# EAGLE board piezo-driver_v0.95-R001 (EAGLE 6.5.0), part 1 of 2
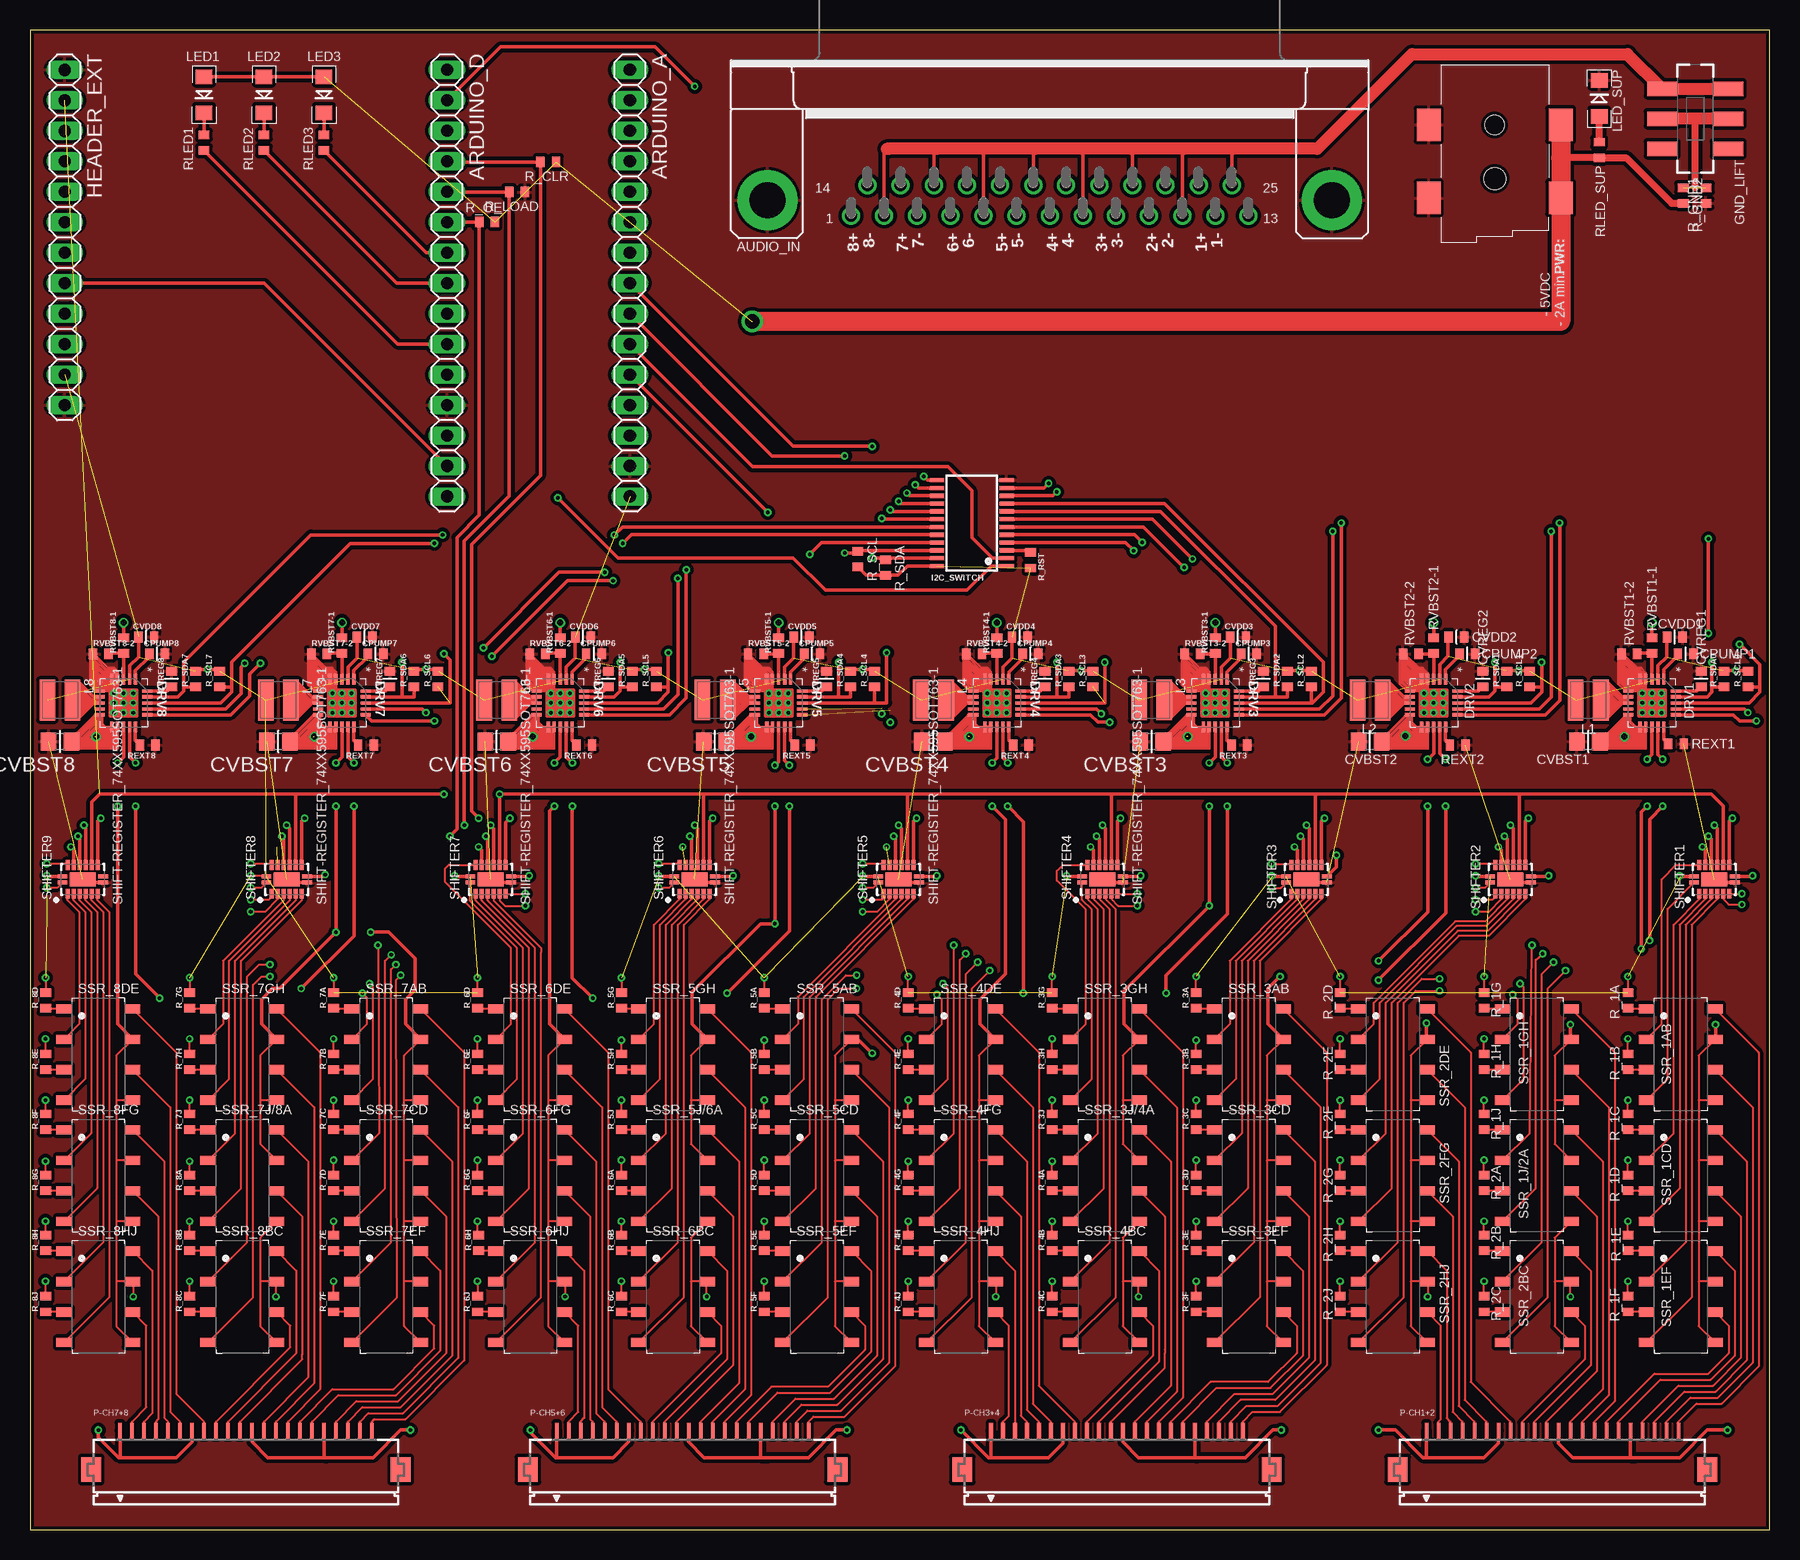
[diagram p5: board, top side]
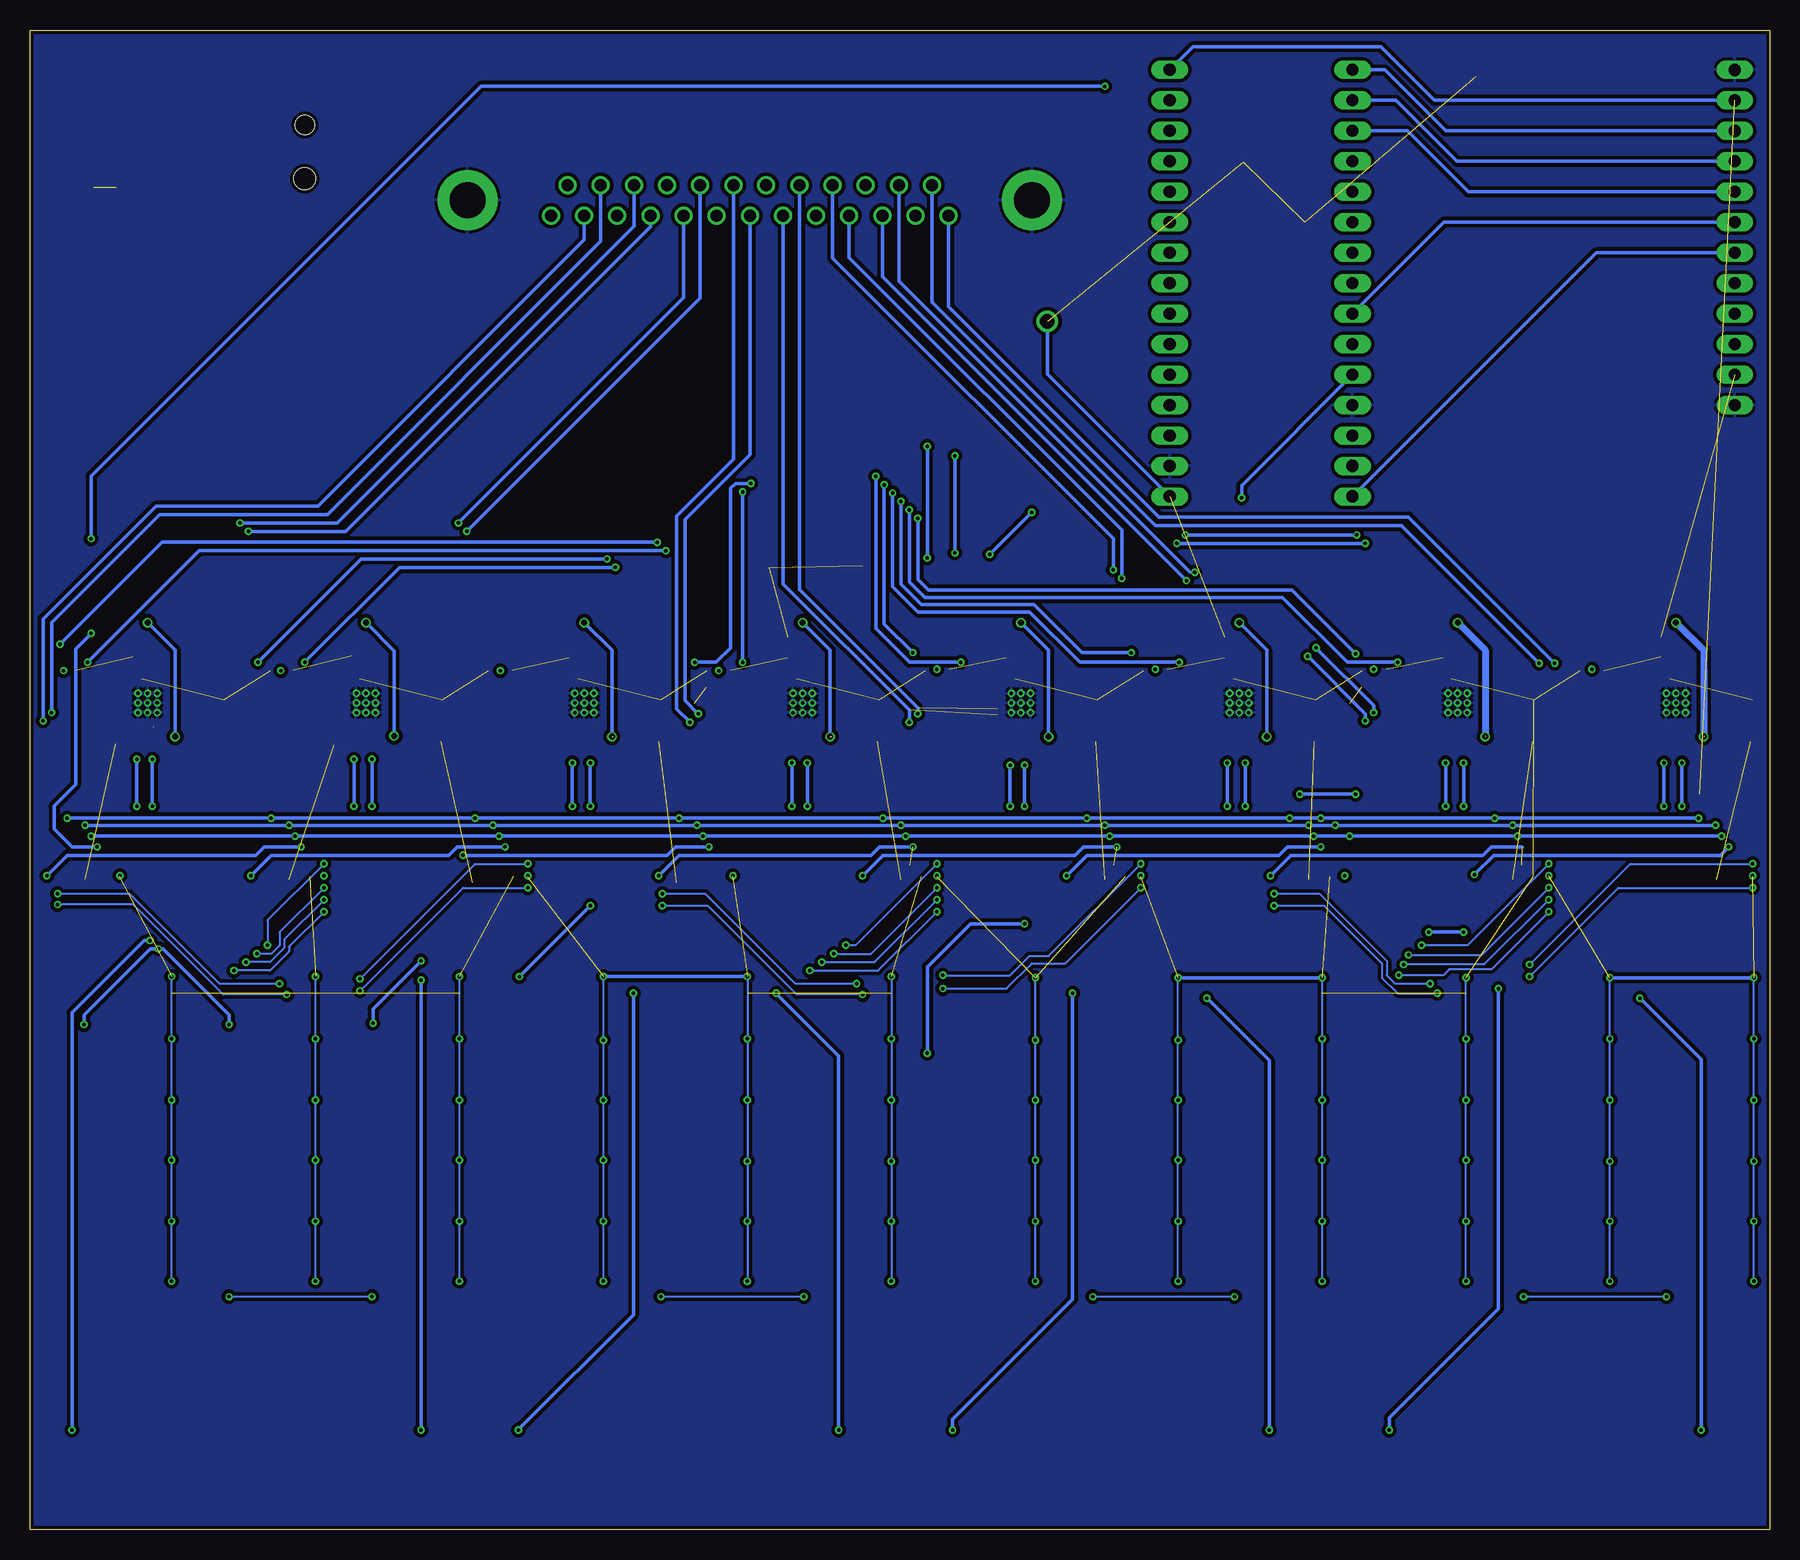
[diagram p6: board, bottom side, seen from below]

Size 145 x 125 mm. Coordinates in mm from the lower left corner, seen from the top.
Outline: 0,0 145,0 145,125 0,125 0,0
Copper layers (1*16): Top 0.035mm / dielectric 1.5mm / Bottom 0.035mm
Design rules "2L-1.6mm-0.15_0.3mm *": minimum track width 0.15mm, minimum drill 0.3mm, track to track 0.15mm, track to pad 0.15mm, pad to pad 0.15mm, via to via 0.15mm, smd to smd 0.15mm, copper to edge 0.3mm, drill to drill 0.5mm, minimum pad ring 0.15mm, minimum via ring 0.15mm, stop-mask expansion 0.1mm, vias tented up to drill 0.8mm, thermal gap 0.25mm

## Footprints (pad centres in the part's own frame; a part is rotated, then mirrored left to right if it is on the bottom)
1X15 = drill 1.016 long: 1 -17.78,0; 2 -15.24,0; 3 -12.7,0; 4 -10.16,0; 5 -7.62,0; 6 -5.08,0; 7 -2.54,0; 8 0,0; 9 2.54,0; 10 5.08,0; 11 7.62,0; 12 10.16,0; 13 12.7,0; 14 15.24,0; 15 17.78,0
F25HP = drill 1: 1 -16.561,-1.27; 2 -13.792,-1.27; 3 -11.049,-1.27; 4 -8.28,-1.27; 5 -5.512,-1.27; 6 -2.769,-1.27; 7 0,-1.27; 8 2.769,-1.27; 9 5.512,-1.27; 10 8.28,-1.27; 11 11.049,-1.27; 12 13.792,-1.27; 13 16.561,-1.27; 14 -15.189,1.27; 15 -12.421,1.27; 16 -9.652,1.27; 17 -6.909,1.27; 18 -4.14,1.27; 19 -1.372,1.27; 20 1.372,1.27; 21 4.14,1.27; 22 6.909,1.27; 23 9.652,1.27; 24 12.421,1.27; 25 15.189,1.27 | drill 3 pad 5: G1 -23.52,0; G2 23.52,0
C0402 = smd 0.7 x 0.9: 1 -0.65,0; 2 0.65,0
C0805 = smd 1.3 x 1.5: 1 -0.95,0; 2 0.95,0
QFN-20_9TH = smd 0.85 x 0.28: 1 -1.981,0.991; 2 -1.981,0.508; 3 -1.981,0; 4 -1.981,-0.508; 5 -1.981,-0.991; 11 1.981,-0.991; 12 1.981,-0.508; 13 1.981,0; 14 1.981,0.508; 15 1.981,0.991 | smd 0.28 x 0.85: 6 -0.991,-1.981; 7 -0.508,-1.981; 8 0,-1.981; 9 0.508,-1.981; 10 0.991,-1.981; 16 0.991,1.981; 17 0.508,1.981; 18 0,1.981; 19 -0.508,1.981; 20 -0.991,1.981 | drill 0.3 pad 0.5: PAD1 -0.8,0.8; PAD2 0,0.8; PAD3 0.8,0.8; PAD4 -0.8,0; PAD5 0,0; PAD6 0.8,0; PAD7 -0.8,-0.8; PAD8 0,-0.8; PAD9 0.8,-0.8
SWITCH_JS202011 = smd 1.2 x 2.5: 1 -2.5,-2.75; 2 0,-2.75; 3 2.5,-2.75; 4 2.5,2.75; 5 0,2.75; 6 -2.5,2.75
1X12 = drill 1.016 long: 1 -13.97,0; 2 -11.43,0; 3 -8.89,0; 4 -6.35,0; 5 -3.81,0; 6 -1.27,0; 7 1.27,0; 8 3.81,0; 9 6.35,0; 10 8.89,0; 11 11.43,0; 12 13.97,0
TSSOP24 = smd 0.35 x 1.2: 1 -3.575,-2.9; 2 -2.925,-2.9; 3 -2.275,-2.9; 4 -1.625,-2.9; 5 -0.975,-2.9; 6 -0.325,-2.9; 7 0.325,-2.9; 8 0.975,-2.9; 9 1.625,-2.9; 10 2.275,-2.9; 11 2.925,-2.9; 12 3.575,-2.9; 13 3.575,2.9; 14 2.925,2.9; 15 2.275,2.9; 16 1.625,2.9; 17 0.975,2.9; 18 0.325,2.9; 19 -0.325,2.9; 20 -0.975,2.9; 21 -1.625,2.9; 22 -2.275,2.9; 23 -2.925,2.9; 24 -3.575,2.9
L3030 = smd 1.3 x 3.4: 1 -1.05,0; 2 1.05,0
LED-1206 = smd 1.2 x 1.4: A -1.5,0; C 1.5,0
FH12-22S-1SH = smd 0.3 x 1.3: 1 -10.5,3.25; 2 -9.5,3.25; 3 -8.5,3.25; 4 -7.5,3.25; 5 -6.5,3.25; 6 -5.5,3.25; 7 -4.5,3.25; 8 -3.5,3.25; 9 -2.5,3.25; 10 -1.5,3.25; 11 -0.5,3.25; 12 0.5,3.25; 13 1.5,3.25; 14 2.5,3.25; 15 3.5,3.25; 16 4.5,3.25; 17 5.5,3.25; 18 6.5,3.25; 19 7.5,3.25; 20 8.5,3.25; 21 9.5,3.25; 22 10.5,3.25 | smd 1.65 x 2.05: PAD1 -12.9,0; PAD2 12.9,0
LUMBERG-1613_14 = smd 2 x 2.7: 1 5.5,5; 2 5.5,11.1; 3 -5.5,11.1; 4 -5.5,5 | hole 1.6: 0,5 | hole 1.8: 0,9.5
R0402 = smd 0.7 x 0.9: 1 -0.65,0; 2 0.65,0
SOT763-1 = smd 0.8 x 0.35: 1 -1.7,-0.25; 8 1.7,-0.25; 9 1.7,0.25; 16 -1.7,0.25 | smd 0.35 x 0.8: 2 -1.25,-1.2; 3 -0.75,-1.2; 4 -0.25,-1.2; 5 0.25,-1.2; 6 0.75,-1.2; 7 1.25,-1.2; 10 1.25,1.2; 11 0.75,1.2; 12 0.25,1.2; 13 -0.25,1.2; 14 -0.75,1.2; 15 -1.25,1.2 | smd 2.15 x 1.15: PAD 0,0
SOP8 = smd 0.76 x 1.27: 1 -3.81,-2.86; 2 -1.27,-2.86; 3 1.27,-2.86; 4 3.81,-2.86; 5 3.81,2.86; 6 1.27,2.86; 7 -1.27,2.86; 8 -3.81,2.86

## Placement (x,y rotation side)
ARDUINO_A  [1X15]  50,103.9 270 top
ARDUINO_D  [1X15]  34.76,103.9 270 top
AUDIO_IN  [F25HP]  85,110.8 0 top
CPUMP1  0.1u  [C0402]  138,73 0 top
CPUMP2  0.1u  [C0402]  119.8,73 0 top
CPUMP3  0.1u  [C0402]  101.6,73 0 top
CPUMP4  0.1u  [C0402]  83.4,73 0 top
CPUMP5  0.1u  [C0402]  65.2,73 0 top
CPUMP6  0.1u  [C0402]  47,73 0 top
CPUMP7  0.1u  [C0402]  28.8,73 0 top
CPUMP8  0.1u  [C0402]  10.6,73 0 top
CVBST1  100n, 250V  [C0805]  129.9,65.7 180 top
CVBST2  100n, 250V  [C0805]  111.7,65.7 180 top
CVBST3  100n, 250V  [C0805]  93.5,65.7 180 top
CVBST4  100n, 250V  [C0805]  75.3,65.7 180 top
CVBST5  100n, 250V  [C0805]  57.1,65.7 180 top
CVBST6  100n, 250V  [C0805]  38.9,65.7 180 top
CVBST7  100n, 250V  [C0805]  20.7,65.7 180 top
CVBST8  100n, 250V  [C0805]  2.5,65.7 180 top
CVDD1  47u  [C0402]  137.1,74.4 0 top
CVDD2  47u  [C0402]  118.9,74.4 0 top
CVDD3  47u  [C0402]  100.7,74.4 0 top
CVDD4  47u  [C0402]  82.5,74.4 0 top
CVDD5  47u  [C0402]  64.3,74.4 0 top
CVDD6  47u  [C0402]  46.1,74.4 0 top
CVDD7  47u  [C0402]  27.9,74.4 0 top
CVDD8  47u  [C0402]  9.7,74.4 0 top
CVREG1  0.1u  [C0402]  139.3,70.9 90 top
CVREG2  0.1u  [C0402]  121.1,70.9 90 top
CVREG3  0.1u  [C0402]  102.8,70.9 90 top
CVREG4  0.1u  [C0402]  84.6,70.9 90 top
CVREG5  0.1u  [C0402]  66.4,70.9 90 top
CVREG6  0.1u  [C0402]  48.2,70.9 90 top
CVREG7  0.1u  [C0402]  30,70.9 90 top
CVREG8  0.1u  [C0402]  11.8,70.9 90 top
DRV1  DRV2667  [QFN-20_9TH]  135.2,68.9 270 top
DRV2  DRV2667  [QFN-20_9TH]  117,68.9 270 top
DRV3  DRV2667  [QFN-20_9TH]  98.8,68.9 270 top
DRV4  DRV2667  [QFN-20_9TH]  80.6,68.9 270 top
DRV5  DRV2667  [QFN-20_9TH]  62.4,68.9 270 top
DRV6  DRV2667  [QFN-20_9TH]  44.2,68.9 270 top
DRV7  DRV2667  [QFN-20_9TH]  26,68.9 270 top
DRV8  DRV2667  [QFN-20_9TH]  7.8,68.9 270 top
GND_LIFT  SWITCH_DPDT  [SWITCH_JS202011]  138.8,117.6 270 top
HEADER_EXT  [1X12]  2.9,107.7 270 top
I2C_SWITCH  I2C-SWITCH_8-1TSSOP24  [TSSOP24]  78.5,83.9 90 top
L1  10u, 2.5A  [L3030]  129.89,69.14 180 top
L2  10u, 2.5A  [L3030]  111.71,69.15 180 top
L3  10u, 2.5A  [L3030]  93.5,69.16 180 top
L4  10u, 2.5A  [L3030]  75.3,69.15 180 top
L5  10u, 2.5A  [L3030]  57.1,69.16 180 top
L6  10u, 2.5A  [L3030]  38.9,69.15 180 top
L7  10u, 2.5A  [L3030]  20.7,69.15 180 top
L8  10u, 2.5A  [L3030]  2.5,69.15 180 top
LED1  red  [LED-1206]  14.5,119.6 270 top
LED2  orange  [LED-1206]  19.5,119.6 270 top
LED3  yellow  [LED-1206]  24.5,119.6 270 top
LED_SUP  green  [LED-1206]  130.8,119.3 90 top
P-CH1+2  FH12-22S-1SH-90°  [FH12-22S-1SH]  126.9,5 0 top
P-CH3+4  FH12-22S-1SH-90°  [FH12-22S-1SH]  90.6,5 0 top
P-CH5+6  FH12-22S-1SH-90°  [FH12-22S-1SH]  54.4,5 0 top
P-CH7+8  FH12-22S-1SH-90°  [FH12-22S-1SH]  18,5 0 top
PWR:  LUMBERG-1613-14"  [LUMBERG-1613_14]  122.1,122.1 180 top
R_1A  3.57k  [R0402]  133.2,44.1 90 top
R_1B  3.57k  [R0402]  133.2,39 90 top
R_1C  3.57k  [R0402]  133.2,34 90 top
R_1D  3.57k  [R0402]  133.2,28.9 90 top
R_1E  3.57k  [R0402]  133.2,23.9 90 top
R_1F  3.57k  [R0402]  133.2,18.8 90 top
R_1G  3.57k  [R0402]  121.2,44.1 90 top
R_1H  3.57k  [R0402]  121.2,39 90 top
R_1J  3.57k  [R0402]  121.2,34 90 top
R_2A  3.57k  [R0402]  121.2,28.9 90 top
R_2B  3.57k  [R0402]  121.2,23.9 90 top
R_2C  3.57k  [R0402]  121.2,18.8 90 top
R_2D  3.57k  [R0402]  109.2,44.1 90 top
R_2E  3.57k  [R0402]  109.2,39 90 top
R_2F  3.57k  [R0402]  109.2,34 90 top
R_2G  3.57k  [R0402]  109.2,28.9 90 top
R_2H  3.57k  [R0402]  109.2,23.9 90 top
R_2J  3.57k  [R0402]  109.2,18.8 90 top
R_3A  3.57k  [R0402]  97.2,44.1 90 top
R_3B  3.57k  [R0402]  97.2,39 90 top
R_3C  3.57k  [R0402]  97.2,34 90 top
R_3D  3.57k  [R0402]  97.2,28.9 90 top
R_3E  3.57k  [R0402]  97.2,23.9 90 top
R_3F  3.57k  [R0402]  97.2,18.8 90 top
R_3G  3.57k  [R0402]  85.2,44.1 90 top
R_3H  3.57k  [R0402]  85.2,39 90 top
R_3J  3.57k  [R0402]  85.2,34 90 top
R_4A  3.57k  [R0402]  85.2,28.9 90 top
R_4B  3.57k  [R0402]  85.2,23.9 90 top
R_4C  3.57k  [R0402]  85.2,18.8 90 top
R_4D  3.57k  [R0402]  73.2,44.1 90 top
R_4E  3.57k  [R0402]  73.2,39 90 top
R_4F  3.57k  [R0402]  73.2,34 90 top
R_4G  3.57k  [R0402]  73.2,28.9 90 top
R_4H  3.57k  [R0402]  73.2,23.9 90 top
R_4J  3.57k  [R0402]  73.2,18.8 90 top
R_5A  3.57k  [R0402]  61.2,44.1 90 top
R_5B  3.57k  [R0402]  61.2,39 90 top
R_5C  3.57k  [R0402]  61.2,34 90 top
R_5D  3.57k  [R0402]  61.2,28.9 90 top
R_5E  3.57k  [R0402]  61.2,23.9 90 top
R_5F  3.57k  [R0402]  61.2,18.8 90 top
R_5G  3.57k  [R0402]  49.3,44.1 90 top
R_5H  3.57k  [R0402]  49.3,39 90 top
R_5J  3.57k  [R0402]  49.3,34 90 top
R_6A  3.57k  [R0402]  49.3,28.9 90 top
R_6B  3.57k  [R0402]  49.3,23.9 90 top
R_6C  3.57k  [R0402]  49.3,18.8 90 top
R_6D  3.57k  [R0402]  37.3,44.1 90 top
R_6E  3.57k  [R0402]  37.3,39 90 top
R_6F  3.57k  [R0402]  37.3,34 90 top
R_6G  3.57k  [R0402]  37.3,28.9 90 top
R_6H  3.57k  [R0402]  37.4,23.9 90 top
R_6J  3.57k  [R0402]  37.3,18.8 90 top
R_7A  3.57k  [R0402]  25.3,44.1 90 top
R_7B  3.57k  [R0402]  25.3,39 90 top
R_7C  3.57k  [R0402]  25.3,34 90 top
R_7D  3.57k  [R0402]  25.3,28.9 90 top
R_7E  3.57k  [R0402]  25.3,23.9 90 top
R_7F  3.57k  [R0402]  25.3,18.8 90 top
R_7G  3.57k  [R0402]  13.3,44.1 90 top
R_7H  3.57k  [R0402]  13.3,39 90 top
R_7J  3.57k  [R0402]  13.3,34 90 top
R_8A  3.57k  [R0402]  13.3,28.9 90 top
R_8B  3.57k  [R0402]  13.3,23.9 90 top
R_8C  3.57k  [R0402]  13.3,18.8 90 top
R_8D  3.57k  [R0402]  1.3,44.1 90 top
R_8E  3.57k  [R0402]  1.3,39 90 top
R_8F  3.57k  [R0402]  1.3,34 90 top
R_8G  3.57k  [R0402]  1.3,28.9 90 top
R_8H  3.57k  [R0402]  1.3,23.9 90 top
R_8J  3.57k  [R0402]  1.3,18.8 90 top
R_CLR  4.75k  [R0402]  43.2,114 0 top
R_GND1  100k  [R0402]  139.7,111.2 90 top
R_GND2  100k  [R0402]  137.8,111.2 270 top
R_LOAD  4.75k  [R0402]  40.6,111.5 180 top
R_OE  4.75k  [R0402]  38.1,109 0 top
R_RST  4.75k  [R0402]  83.4,80.8 270 top
R_SCL  4.75k  [R0402]  69,80.9 270 top
R_SCL0  4.75k  [R0402]  143.2,70.9 90 top
R_SCL1  4.75k  [R0402]  125,70.9 90 top
R_SCL2  4.75k  [R0402]  106.8,70.9 90 top
R_SCL3  4.75k  [R0402]  88.6,70.9 90 top
R_SCL4  4.75k  [R0402]  70.4,70.9 90 top
R_SCL5  4.75k  [R0402]  52.2,70.9 90 top
R_SCL6  4.75k  [R0402]  34,70.9 90 top
R_SCL7  4.75k  [R0402]  15.8,70.9 90 top
R_SDA  4.75k  [R0402]  71.3,80.2 270 top
R_SDA0  4.75k  [R0402]  141.2,70.9 90 top
R_SDA1  4.75k  [R0402]  123.1,70.9 90 top
R_SDA2  4.75k  [R0402]  104.8,70.9 90 top
R_SDA3  4.75k  [R0402]  86.6,70.9 90 top
R_SDA4  4.75k  [R0402]  68.4,70.9 90 top
R_SDA5  4.75k  [R0402]  50.2,70.9 90 top
R_SDA6  4.75k  [R0402]  32,70.9 90 top
R_SDA7  4.75k  [R0402]  13.8,70.9 90 top
REXT1  6k  [R0402]  137.2,65.5 180 top
REXT2  6k  [R0402]  119,65.4 180 top
REXT3  6k  [R0402]  100.8,65.4 180 top
REXT4  6k  [R0402]  82.6,65.4 180 top
REXT5  6k  [R0402]  64.4,65.4 180 top
REXT6  6k  [R0402]  46.2,65.4 180 top
REXT7  6k  [R0402]  28,65.4 180 top
REXT8  6k  [R0402]  9.8,65.4 180 top
RLED1  1.0k  [R0402]  14.5,115.6 90 top
RLED2  1.0k  [R0402]  19.5,115.6 90 top
RLED3  1.0k  [R0402]  24.5,115.6 90 top
RLED_SUP  1k  [R0402]  130.8,115 270 top
RVBST1-1  768k  [R0402]  135.2,73.7 90 top
RVBST1-2  9.76k  [R0402]  133.3,73 0 top
RVBST2-1  768k  [R0402]  117,73.7 90 top
RVBST2-2  9.76k  [R0402]  115.1,73 0 top
RVBST3-1  768k  [R0402]  98.8,73.7 90 top
RVBST3-2  9.76k  [R0402]  96.9,73 0 top
RVBST4-1  768k  [R0402]  80.6,73.7 90 top
RVBST4-2  9.76k  [R0402]  78.7,73 0 top
RVBST5-1  768k  [R0402]  62.4,73.7 90 top
RVBST5-2  9.76k  [R0402]  60.5,73 0 top
RVBST6-1  768k  [R0402]  44.2,73.7 90 top
RVBST6-2  9.76k  [R0402]  42.3,73 0 top
RVBST7-1  768k  [R0402]  26,73.7 90 top
RVBST7-2  9.76k  [R0402]  24.1,73 0 top
RVBST8-1  768k  [R0402]  7.8,73.7 90 top
RVBST8-2  9.76k  [R0402]  5.9,73 0 top
SHIFTER1  SHIFT-REGISTER_74XX595SOT763-1  [SOT763-1]  140.4,54.2 0 top
SHIFTER2  SHIFT-REGISTER_74XX595SOT763-1  [SOT763-1]  123.4,54.2 0 top
SHIFTER3  SHIFT-REGISTER_74XX595SOT763-1  [SOT763-1]  106.4,54.2 0 top
SHIFTER4  SHIFT-REGISTER_74XX595SOT763-1  [SOT763-1]  89.4,54.2 0 top
SHIFTER5  SHIFT-REGISTER_74XX595SOT763-1  [SOT763-1]  72.4,54.2 0 top
SHIFTER6  SHIFT-REGISTER_74XX595SOT763-1  [SOT763-1]  55.4,54.2 0 top
SHIFTER7  SHIFT-REGISTER_74XX595SOT763-1  [SOT763-1]  38.4,54.2 0 top
SHIFTER8  SHIFT-REGISTER_74XX595SOT763-1  [SOT763-1]  21.4,54.2 0 top
SHIFTER9  SHIFT-REGISTER_74XX595SOT763-1  [SOT763-1]  4.4,54.2 0 top
SSR_1AB  SSR_COTO_C334S  [SOP8]  137.6,39.6 270 top
SSR_1CD  SSR_COTO_C334S  [SOP8]  137.6,29.5 270 top
SSR_1EF  SSR_COTO_C334S  [SOP8]  137.6,19.4 270 top
SSR_1GH  SSR_COTO_C334S  [SOP8]  125.6,39.6 270 top
SSR_1J/2A  SSR_COTO_C334S  [SOP8]  125.6,29.5 270 top
SSR_2BC  SSR_COTO_C334S  [SOP8]  125.6,19.4 270 top
SSR_2DE  SSR_COTO_C334S  [SOP8]  113.6,39.6 270 top
SSR_2FG  SSR_COTO_C334S  [SOP8]  113.6,29.5 270 top
SSR_2HJ  SSR_COTO_C334S  [SOP8]  113.6,19.4 270 top
SSR_3AB  SSR_COTO_C334S  [SOP8]  101.6,39.6 270 top
SSR_3CD  SSR_COTO_C334S  [SOP8]  101.6,29.5 270 top
SSR_3EF  SSR_COTO_C334S  [SOP8]  101.6,19.4 270 top
SSR_3GH  SSR_COTO_C334S  [SOP8]  89.6,39.6 270 top
SSR_3J/4A  SSR_COTO_C334S  [SOP8]  89.6,29.5 270 top
SSR_4BC  SSR_COTO_C334S  [SOP8]  89.6,19.4 270 top
SSR_4DE  SSR_COTO_C334S  [SOP8]  77.6,39.6 270 top
SSR_4FG  SSR_COTO_C334S  [SOP8]  77.6,29.5 270 top
SSR_4HJ  SSR_COTO_C334S  [SOP8]  77.6,19.4 270 top
SSR_5AB  SSR_COTO_C334S  [SOP8]  65.6,39.6 270 top
SSR_5CD  SSR_COTO_C334S  [SOP8]  65.6,29.5 270 top
SSR_5EF  SSR_COTO_C334S  [SOP8]  65.6,19.4 270 top
SSR_5GH  SSR_COTO_C334S  [SOP8]  53.6,39.6 270 top
SSR_5J/6A  SSR_COTO_C334S  [SOP8]  53.6,29.5 270 top
SSR_6BC  SSR_COTO_C334S  [SOP8]  53.6,19.4 270 top
SSR_6DE  SSR_COTO_C334S  [SOP8]  41.7,39.6 270 top
SSR_6FG  SSR_COTO_C334S  [SOP8]  41.7,29.5 270 top
SSR_6HJ  SSR_COTO_C334S  [SOP8]  41.7,19.4 270 top
SSR_7AB  SSR_COTO_C334S  [SOP8]  29.7,39.6 270 top
SSR_7CD  SSR_COTO_C334S  [SOP8]  29.7,29.5 270 top
SSR_7EF  SSR_COTO_C334S  [SOP8]  29.7,19.4 270 top
SSR_7GH  SSR_COTO_C334S  [SOP8]  17.7,39.6 270 top
SSR_7J/8A  SSR_COTO_C334S  [SOP8]  17.7,29.5 270 top
SSR_8BC  SSR_COTO_C334S  [SOP8]  17.7,19.4 270 top
SSR_8DE  SSR_COTO_C334S  [SOP8]  5.7,39.6 270 top
SSR_8FG  SSR_COTO_C334S  [SOP8]  5.7,29.5 270 top
SSR_8HJ  SSR_COTO_C334S  [SOP8]  5.7,19.4 270 top

## Tracks (layer width: path | path; a pad name or v marks a point on that pad's centre or on a via)
0V  (9 unrouted)
  Top 0.2: 134.7,70.9 134.7,71.4 134.3,71.8 134,71.8 132.8,73 132.4,73 132.4,70.5 133,69.9 133.3,69.9 | 133.3,69.9 134.7,69.9 134.7,70.9 | 134.7,70.9 134.6,70.9 | 134.2,70.9 134.6,70.9 | 134.6,70.9 134.6,71.3 134.2,71.7 134,71.7 132.9,72.8 132.5,72.8 132.5,70.6 133,70.1 133.4,70.1 133.4,71 134.5,71 134.5,71.2 134.1,71.6 133.9,71.6 133,72.5 132.6,72.5 132.6,70.7 133.1,70.2 133.3,70.2 133.3,71.1 134.4,71.1 134,71.5 133.8,71.5 132.9,72.4 132.7,72.4 132.7,70.8 133.2,70.3 133.2,71.2 134,71.2 134,71.3 133.9,71.4 133.7,71.4 132.8,72.3 132.8,70.9 133.1,70.6 133.1,71.3 133.6,71.3 132.9,72 132.9,71 133,70.9 133,71.7 133.1,71.7 133.4,71.4 133.1,71.4 133.1,71.5 | DRV1.5 134.21,70.89 134.2,70.9 | DRV1.6 133.29,69.89 133.3,69.9 | 133.5,70 133.5,70.9 134.2,70.9 | 134.6,70.9 134.6,70 133.6,70 133.6,70.8 134.5,70.8 134.5,70.1 133.7,70.1 133.7,70.7 134.4,70.7 134.4,70.2 133.8,70.2 133.8,70.6 134.3,70.6 134.3,70.4 | 134.3,70.4 134.3,70.3 133.9,70.3 133.9,70.4 134.3,70.4 | 116.5,70.9 116.5,71.4 116.1,71.8 115.8,71.8 114.6,73 114.2,73 114.2,70.5 114.8,69.9 115.1,69.9 | 115.1,69.9 116.5,69.9 116.5,70.9 | 116.5,70.9 116.4,70.9 | 116,70.9 116.4,70.9 | 116.4,70.9 116.4,71.3 116,71.7 115.8,71.7 114.7,72.8 114.3,72.8 114.3,70.6 114.8,70.1 115.2,70.1 115.2,71 116.3,71 116.3,71.2 115.9,71.6 115.7,71.6 114.8,72.5 114.4,72.5 114.4,70.7 114.9,70.2 115.1,70.2 115.1,71.1 116.2,71.1 115.8,71.5 115.6,71.5 114.7,72.4 114.5,72.4 114.5,70.8 115,70.3 115,71.2 115.8,71.2 115.8,71.3 115.7,71.4 115.5,71.4 114.6,72.3 114.6,70.9 114.9,70.6 114.9,71.3 115.4,71.3 114.7,72 114.7,71 114.8,70.9 114.8,71.7 114.9,71.7 115.2,71.4 114.9,71.4 114.9,71.5
  Top 0.2: DRV2.5 116.01,70.89 116,70.9 | DRV2.6 115.09,69.89 115.1,69.9 | 115.3,70 115.3,70.9 116,70.9 | 116.4,70.9 116.4,70 115.4,70 115.4,70.8 116.3,70.8 116.3,70.1 115.5,70.1 115.5,70.7 116.2,70.7 116.2,70.2 115.6,70.2 115.6,70.6 116.1,70.6 116.1,70.4 | 116.1,70.4 116.1,70.3 115.7,70.3 115.7,70.4 116.1,70.4 | 98.3,71.4 98.3,71.5 98,71.8 97.5,71.8 96.5,72.8 96.3,72.8 | 96.3,72.8 96,72.8 96,70.4 96.5,69.9 DRV3.6 | DRV3.6 98.3,69.9 DRV3.4 | DRV3.4 98.3,71.4 | 98.3,71.4 98,71.7 97.4,71.7 96.5,72.6 96.1,72.6 96.1,70.5 96.5,70.1 98.2,70.1 98.2,71.3 97.9,71.6 97.3,71.6 96.4,72.5 96.2,72.5 96.2,70.6 96.6,70.2 98.1,70.2 98.1,71.2 97.8,71.5 97.2,71.5 96.3,72.4 96.3,70.7 96.7,70.3 98,70.3 98,71.1 97.7,71.4 97.1,71.4 96.4,72.1 96.4,70.8 96.8,70.4 97.8,70.4 97.8,70.89 | 97.8,70.89 97.8,71.2 97.7,71.3 97,71.3 96.5,71.8 96.5,70.9 96.9,70.5 97.7,70.5 97.7,71.2 96.9,71.2 96.6,71.5 96.6,71 97,70.6 97.6,70.6 97.6,71.1 96.8,71.1 96.7,71.2 96.7,71.1 97.1,70.7 97.5,70.7 97.5,71 97,71 97.2,70.8 97.4,70.8 97.4,70.9 97.2,70.9 | DRV3.6 | DRV3.5 97.8,70.89 | DRV3.4 | RVBST3-2.1 96.3,72.95 96.3,72.8 | 80.1,71.4 80.1,71.5 79.8,71.8 79.3,71.8 78.3,72.8 78.1,72.8 | 78.1,72.8 77.8,72.8 77.8,70.4 78.3,69.9 DRV4.6 | DRV4.6 80.1,69.9 DRV4.4 | DRV4.4 80.1,71.4 | 80.1,71.4 79.8,71.7 79.2,71.7 78.3,72.6 77.9,72.6 77.9,70.5 78.3,70.1 80,70.1 80,71.3 79.7,71.6 79.1,71.6 78.2,72.5 78,72.5 78,70.6 78.4,70.2 79.9,70.2 79.9,71.2 79.6,71.5 79,71.5 78.1,72.4 78.1,70.7 78.5,70.3 79.8,70.3 79.8,71.1 79.5,71.4 78.9,71.4 78.2,72.1 78.2,70.8 78.6,70.4 79.6,70.4 79.6,70.89 | 79.6,70.89 79.6,71.2 79.5,71.3 78.8,71.3 78.3,71.8 78.3,70.9 78.7,70.5 79.5,70.5 79.5,71.2 78.7,71.2 78.4,71.5 78.4,71 78.8,70.6 79.4,70.6 79.4,71.1 78.6,71.1 78.5,71.2 78.5,71.1 78.9,70.7 79.3,70.7 79.3,71 78.8,71 79,70.8 79.2,70.8 79.2,70.9 79,70.9
  Top 0.2: DRV4.6 | DRV4.5 79.6,70.89 | DRV4.4 | RVBST4-2.1 78.1,72.95 78.1,72.8 | 61.9,71.4 61.9,71.5 61.6,71.8 61.1,71.8 60.1,72.8 59.9,72.8 | 59.9,72.8 59.6,72.8 59.6,70.4 60.1,69.9 DRV5.6 | DRV5.6 61.9,69.9 DRV5.4 | DRV5.4 61.9,71.4 | 61.9,71.4 61.6,71.7 61,71.7 60.1,72.6 59.7,72.6 59.7,70.5 60.1,70.1 61.8,70.1 61.8,71.3 61.5,71.6 60.9,71.6 60,72.5 59.8,72.5 59.8,70.6 60.2,70.2 61.7,70.2 61.7,71.2 61.4,71.5 60.8,71.5 59.9,72.4 59.9,70.7 60.3,70.3 61.6,70.3 61.6,71.1 61.3,71.4 60.7,71.4 60,72.1 60,70.8 60.4,70.4 61.4,70.4 61.4,70.89 | 61.4,70.89 61.4,71.2 61.3,71.3 60.6,71.3 60.1,71.8 60.1,70.9 60.5,70.5 61.3,70.5 61.3,71.2 60.5,71.2 60.2,71.5 60.2,71 60.6,70.6 61.2,70.6 61.2,71.1 60.4,71.1 60.3,71.2 60.3,71.1 60.7,70.7 61.1,70.7 61.1,71 60.6,71 60.8,70.8 61,70.8 61,70.9 60.8,70.9 | DRV5.6 | DRV5.5 61.4,70.89 | DRV5.4 | RVBST5-2.1 59.9,72.95 59.9,72.8 | 43.7,71.4 43.7,71.5 43.4,71.8 42.9,71.8 41.9,72.8 41.7,72.8 | 41.7,72.8 41.4,72.8 41.4,70.4 41.9,69.9 DRV6.6 | DRV6.6 43.7,69.9 DRV6.4 | DRV6.4 43.7,71.4 | 43.7,71.4 43.4,71.7 42.8,71.7 41.9,72.6 41.5,72.6 41.5,70.5 41.9,70.1 43.6,70.1 43.6,71.3 43.3,71.6 42.7,71.6 41.8,72.5 41.6,72.5 41.6,70.6 42,70.2 43.5,70.2 43.5,71.2 43.2,71.5 42.6,71.5 41.7,72.4 41.7,70.7 42.1,70.3 43.4,70.3 43.4,71.1 43.1,71.4 42.5,71.4 41.8,72.1 41.8,70.8 42.2,70.4 43.2,70.4 43.2,70.89 | 43.2,70.89 43.2,71.2 43.1,71.3 42.4,71.3 41.9,71.8 41.9,70.9 42.3,70.5 43.1,70.5 43.1,71.2 42.3,71.2 42,71.5 42,71 42.4,70.6 43,70.6 43,71.1 42.2,71.1 42.1,71.2 42.1,71.1 42.5,70.7 42.9,70.7 42.9,71 42.4,71 42.6,70.8 42.8,70.8 42.8,70.9 42.6,70.9
  Top 0.2: DRV6.6 | DRV6.5 43.2,70.89 | DRV6.4 | RVBST6-2.1 41.7,72.95 41.7,72.8 | 25.5,71.4 25.5,71.5 25.2,71.8 24.7,71.8 23.7,72.8 23.5,72.8 | 23.5,72.8 23.2,72.8 23.2,70.4 23.7,69.9 DRV7.6 | DRV7.6 25.5,69.9 DRV7.4 | DRV7.4 25.5,71.4 | 25.5,71.4 25.2,71.7 24.6,71.7 23.7,72.6 23.3,72.6 23.3,70.5 23.7,70.1 25.4,70.1 25.4,71.3 25.1,71.6 24.5,71.6 23.6,72.5 23.4,72.5 23.4,70.6 23.8,70.2 25.3,70.2 25.3,71.2 25,71.5 24.4,71.5 23.5,72.4 23.5,70.7 23.9,70.3 25.2,70.3 25.2,71.1 24.9,71.4 24.3,71.4 23.6,72.1 23.6,70.8 24,70.4 25,70.4 25,70.89 | 25,70.89 25,71.2 24.9,71.3 24.2,71.3 23.7,71.8 23.7,70.9 24.1,70.5 24.9,70.5 24.9,71.2 24.1,71.2 23.8,71.5 23.8,71 24.2,70.6 24.8,70.6 24.8,71.1 24,71.1 23.9,71.2 23.9,71.1 24.3,70.7 24.7,70.7 24.7,71 24.2,71 24.4,70.8 24.6,70.8 24.6,70.9 24.4,70.9 | DRV7.6 | DRV7.5 25,70.89 | DRV7.4 | RVBST7-2.1 23.5,72.95 23.5,72.8 | 7.3,71.4 7.3,71.5 7,71.8 6.5,71.8 5.5,72.8 5.3,72.8 | 5.3,72.8 5,72.8 5,70.4 5.5,69.9 DRV8.6 | DRV8.6 7.3,69.9 DRV8.4 | DRV8.4 7.3,71.4 | 7.3,71.4 7,71.7 6.4,71.7 5.5,72.6 5.1,72.6 5.1,70.5 5.5,70.1 7.2,70.1 7.2,71.3 6.9,71.6 6.3,71.6 5.4,72.5 5.2,72.5 5.2,70.6 5.6,70.2 7.1,70.2 7.1,71.2 6.8,71.5 6.2,71.5 5.3,72.4 5.3,70.7 5.7,70.3 7,70.3 7,71.1 6.7,71.4 6.1,71.4 5.4,72.1 5.4,70.8 5.8,70.4 6.8,70.4 6.8,70.89 | 6.8,70.89 6.8,71.2 6.7,71.3 6,71.3 5.5,71.8 5.5,70.9 5.9,70.5 6.7,70.5 6.7,71.2 5.9,71.2 5.6,71.5 5.6,71 6,70.6 6.6,70.6 6.6,71.1 5.8,71.1 5.7,71.2 5.7,71.1 6.1,70.7 6.5,70.7 6.5,71 6,71 6.2,70.8 6.4,70.8 6.4,70.9 6.2,70.9 | DRV8.6 | DRV8.5 6.8,70.89 | DRV8.4 | RVBST8-2.1 5.3,72.95 5.3,72.8
  Top 0.3: SHIFTER9.8 4.4,53.95 SHIFTER9.PAD | SHIFTER8.8 21.4,53.95 SHIFTER8.PAD | SHIFTER7.8 38.4,53.95 SHIFTER7.PAD | SHIFTER6.8 55.4,53.95 SHIFTER6.PAD | SHIFTER5.8 72.4,53.95 SHIFTER5.PAD | SHIFTER4.8 89.4,53.95 SHIFTER4.PAD | SHIFTER3.8 106.4,53.95 SHIFTER3.PAD | SHIFTER2.8 123.4,53.95 SHIFTER2.PAD | SHIFTER1.8 140.4,53.95 SHIFTER1.PAD
  pour Top (isolate 0.3): 0,0 145,0 145,125 0,125
  pour Bottom (isolate 0.3): 0,0 145,0 145,125 0,125
+5V  (via drill 0.3, 1.2)  (48 unrouted)
  Top 0.15: R_4D.2 v73.2,46.1 | R_3G.2 v85.2,46.1 | R_4E.2 v73.2,40.9 | R_4F.2 v73.2,35.8 | R_4G.2 v73.2,30.7 | R_4H.2 v73.2,25.7 | R_4J.2 v73.2,20.7 | R_4C.2 v85.2,20.7 | R_4B.2 v85.2,25.7 | R_3H.2 v85.2,40.9 | R_3J.2 v85.2,35.8 | R_4A.2 v85.2,30.7 | R_3B.2 v97.2,40.8 | R_3C.2 v97.2,35.8 | R_3D.2 v97.2,30.8 | R_3E.2 v97.2,25.7 | R_3F.2 v97.2,20.7 | R_2J.2 v109.2,20.7 | v109.2,46.1 R_2D.2 | R_2E.2 v109.2,40.9 | R_2F.2 v109.2,35.8 | R_2H.2 v109.2,25.7 | R_2G.2 v109.2,30.8 | R_1F.2 v133.2,20.7 | v133.2,46.1 R_1A.2 | R_1B.2 v133.2,40.9 | R_1C.2 v133.2,35.8 | R_1D.2 v133.2,30.8 | R_1E.2 v133.2,25.7 | R_2C.2 v121.2,20.7 | v121.2,46.1 R_1G.2 | R_1H.2 v121.2,40.9 | R_1J.2 v121.2,35.8 | R_2B.2 v121.2,25.7 | R_2A.2 v121.2,30.8 | R_6D.2 v37.3,46 | v37.3,20.7 R_6J.2 | R_6H.2 37.3,24.55 v37.3,25.7 | R_6G.2 v37.3,30.8 | R_6F.2 v37.3,35.8 | R_6E.2 v37.3,40.9 | R_6C.2 v49.3,20.7 | v49.3,46 R_5G.2 | R_5H.2 v49.3,40.8 | R_5J.2 v49.3,35.8 | R_6A.2 v49.3,30.8 | R_6B.2 v49.3,25.7 | R_5F.2 v61.2,20.7 | v61.2,46 R_5A.2 | R_5B.2 v61.2,40.8 | R_5C.2 v61.2,35.8 | R_5D.2 v61.2,30.8 | R_5E.2 v61.2,25.7 | R_8J.2 v1.3,20.7 | v1.3,46 R_8D.2 | R_8E.2 v1.3,40.9 | R_8F.2 v1.3,35.8 | R_8G.2 v1.3,30.7 | R_8H.2 v1.3,25.7 | R_8C.2 v13.3,20.7 | v13.3,46 R_7G.2 | R_7H.2 v13.3,40.9 | R_7J.2 v13.3,35.8 | R_8A.2 v13.3,30.7 | R_8B.2 v13.3,25.7 | R_7F.2 v25.3,20.7 | v25.3,46 R_7A.2 | R_7B.2 v25.3,40.9 | R_7C.2 v25.3,35.8 | R_7D.2 v25.3,30.8 | R_7E.2 v25.3,25.7 | SHIFTER8.16 19.7,54.5 v18.4,54.5 | R_3A.2 v97.2,46.1
  Top 0.3: DRV1.2 135.71,72.01 136.45,72.75 CVDD1.1 | DRV2.2 117.51,72.11 118.2,72.8 118.2,74.35 CVDD2.1 | DRV8.2 8.31,72.01 9.05,72.75 CVDD8.1 | DRV7.2 26.51,71.91 27.25,72.65 CVDD7.1 | DRV6.2 44.71,71.91 45.45,72.65 CVDD6.1 | DRV5.2 62.91,71.91 63.65,72.65 CVDD5.1 | DRV4.2 81.11,71.91 81.85,72.65 CVDD4.1 | DRV3.2 99.31,71.91 100.05,72.65 CVDD3.1 | R_SDA7.2 13.95,71.7 v14.8,71.7 15.8,71.7 R_SCL7.2 | R_SDA6.2 32,71.7 v33,71.7 33.85,71.7 R_SCL6.2 | R_SDA5.2 50.2,71.7 v51.2,71.7 52.2,71.7 R_SCL5.2 | R_SCL4.2 70.4,71.7 v69.4,71.7 68.4,71.7 R_SDA4.2 | R_SCL0.2 143.2,71.6 v142.2,71.6 141.2,71.6 R_SDA0.2 | R_SCL1.2 125,71.6 v124.1,71.6 123.1,71.6 R_SDA1.2 | R_SCL2.2 106.8,71.6 v105.8,71.6 104.8,71.6 R_SDA2.2 | R_SCL3.2 88.6,71.6 v87.6,71.6 86.6,71.6 R_SDA3.2 | LED1.A LED2.A LED3.A | SHIFTER7.16 35.45,54.45 v35.4,54.5 | SHIFTER9.16 1.45,54.45 v1.4,54.5 | SHIFTER6.16 52.45,54.45 v52.4,54.5 | SHIFTER5.16 69.45,54.45 v69.4,54.5 | SHIFTER4.16 86.45,54.45 v86.4,54.5 | SHIFTER1.16 137.55,54.45 v137.5,54.5 | SHIFTER2.16 120.55,54.45 v120.5,54.5 | SHIFTER3.16 103.55,54.45 v103.5,54.5 | R_SCL.2 69.7,79.55 R_SDA.2 72.35,79.55 73.12,80.33 I2C_SWITCH.24
  Top 0.6: 127.6,114.35 RLED_SUP.2 133.05,114.35 136.85,110.55 R_GND2.2
  Top 1.6: PWR:.4 127.6,114.35 PWR:.3 127.6,110.5 127.6,100.7 v60.2,100.7
  Bottom 0.15: v73.2,46.1 v73.2,40.9 v73.2,35.8 v73.2,30.7 v73.2,25.7 v73.2,20.7 | v97.2,20.7 v97.2,25.7 v97.2,30.8 v97.2,35.8 v97.2,40.8 v97.2,46.1 | v85.2,46.1 v85.2,40.9 v85.2,35.8 v85.2,30.7 v85.2,25.7 v85.2,20.7 | v109.2,20.7 v109.2,25.7 v109.2,30.8 v109.2,35.8 v109.2,40.9 v109.2,46.1 | v133.2,20.7 v133.2,25.7 v133.2,30.8 v133.2,35.8 v133.2,40.9 v133.2,46.1 | v121.2,20.7 v121.2,25.7 v121.2,30.8 v121.2,35.8 v121.2,40.9 v121.2,46.1 | v37.3,46 v37.3,40.9 v37.3,35.8 v37.3,30.8 v37.3,25.7 v37.3,20.7 | v49.3,20.7 v49.3,25.7 v49.3,30.8 v49.3,35.8 v49.3,40.8 v49.3,46 | v61.2,20.7 v61.2,25.7 v61.2,30.8 v61.2,35.8 v61.2,40.8 v61.2,46 | v1.3,20.7 v1.3,25.7 v1.3,30.7 v1.3,35.8 v1.3,40.9 v1.3,46 | v13.3,20.7 v13.3,25.7 v13.3,30.7 v13.3,35.8 v13.3,40.9 v13.3,46 | v25.3,20.7 v25.3,25.7 v25.3,30.8 v25.3,35.8 v25.3,40.9 v25.3,46
  Bottom 0.3: v1.3,46 v13.3,46 | v37.3,46 v49.3,46 | v97.2,46.1 v85.2,46.1 | ARDUINO_A.15 60.2,96.32 v60.2,100.7
CH1_I+  (via drill 0.3)
  Top 0.3: DRV1.17 142.91,68.39 v143.2,68.1
  Bottom 0.3: AUDIO_IN.24 97.42,107.38 120.2,84.6 134.2,84.6 143.2,75.6 v143.2,68.1
CH1_I-  (via drill 0.3)
  Top 0.3: DRV1.16 141.99,67.91 142.5,67.4 v143.9,67.4
  Bottom 0.3: AUDIO_IN.12 98.79,107.51 121,85.3 134.5,85.3 143.9,75.9 v143.9,67.4
CH1_O+  (via drill 0.3)
  Top 0.15: SSR_1GH.7 127.1,39.51 127.1,35.79 | 127.1,35.79 127.1,32.13 SSR_1J/2A.7 | SSR_1GH.5 127.1,35.79 | SSR_1AB.7 139.1,39.51 139.1,35.79 | 139.1,35.79 139.1,30.77 | 139.1,30.77 139.1,25.69 | 139.1,25.69 139.1,20.67 | 139.1,20.67 139.1,16.95 SSR_1EF.5 | SSR_1EF.7 139.1,20.67 | SSR_1CD.5 139.1,25.69 | SSR_1AB.5 139.1,35.79 | SSR_1CD.7 139.1,30.77
  Top 0.3: DRV1.13 135.2,64.6 v134.8,64.2 | v140.5,42.1 140.5,40.87 SSR_1AB.7 | v128.4,42.1 128.4,40.87 SSR_1GH.7 | v134.8,60.3 134.3,59.8 v134.3,48.4
  Bottom 0.3: v134.8,64.2 v134.8,60.3 | v128.4,42.1 128.4,42.9 133.9,48.4 v134.3,48.4 135,48.4 140.5,42.9 v140.5,42.1
CH1_O-  (via drill 0.3)
  Top 0.3: DRV1.14 135.71,64.59 v136.1,64.2 | v136.1,60.3 135,59.2 v135,49.1 | v141.5,8.3 139.8,8.3 137.5,6 133.9,6 133.4,6 | 133.4,6 128.6,6 127.4,7.2 P-CH1+2.12 | P-CH1+2.18 133.4,6
  Bottom 0.3: v136.1,64.2 v136.1,60.3 | v135,49.1 135.5,49.1 141.5,43.1 v141.5,8.3
CH1_PA+
  Top 0.15: SSR_1AB.8 144.1,39.77 144.1,13.6 141,10.5 138.9,10.5 137.4,9 P-CH1+2.22
CH1_PB+
  Top 0.15: SSR_1AB.6 143.6,35.19 143.6,13.9 140.7,11 138.4,11 136.4,9 P-CH1+2.21
CH1_PC+
  Top 0.15: SSR_1CD.8 143.1,30.67 143.1,14.1 140.5,11.5 137.9,11.5 135.4,9 P-CH1+2.20
CH1_PD+
  Top 0.15: SSR_1CD.6 142.6,26.09 142.6,14.3 140.3,12 137.4,12 134.4,9 P-CH1+2.19
CH1_PE+
  Top 0.15: SSR_1EF.8 142.1,21.57 142.1,14.5 140.1,12.5 135.9,12.5 132.4,9 P-CH1+2.17
CH1_PF+
  Top 0.15: SSR_1EF.6 141.6,16.99 141.6,14.7 139.9,13 135.4,13 131.4,9 P-CH1+2.16
CH1_PG+
  Top 0.15: SSR_1GH.8 132.1,39.77 132.1,10.7 130.4,9 P-CH1+2.15
CH1_PH+
  Top 0.15: SSR_1GH.6 131.6,35.19 131.6,11.2 129.4,9 P-CH1+2.14
CH1_PJ+
  Top 0.15: SSR_1J/2A.8 131.1,30.67 131.1,11.7 128.4,9 P-CH1+2.13
CH2_I+  (via drill 0.3)
  Top 0.3: v126.8,83.2 126.8,69.4 125.79,68.39 DRV2.17
  Bottom 0.3: AUDIO_IN.10 93.28,108.62 118.7,83.2 v126.8,83.2
CH2_I-  (via drill 0.3)
  Top 0.3: v127.5,83.9 127.5,69.1 126.3,67.9 126.29,67.91 DRV2.16
  Bottom 0.3: AUDIO_IN.23 94.65,108.65 119.4,83.9 v127.5,83.9
CH2_O+  (via drill 0.3)
  Top 0.15: SSR_2DE.7 115.1,39.51 115.1,35.79 | 115.1,35.79 115.1,30.77 | 115.1,30.77 115.1,25.69 | 115.1,25.69 115.1,20.67 | 115.1,20.67 115.1,16.95 SSR_2HJ.5 | 115.1,20.67 SSR_2HJ.7 116.5,20.67 v116.5,19.4 | SSR_2FG.5 115.1,25.69 | SSR_2DE.5 115.1,35.79 | SSR_2FG.7 115.1,30.77 | SSR_1J/2A.5 127.1,24.33 127.1,20.67 | 127.1,20.67 127.1,16.95 SSR_2BC.5 | 127.1,20.67 SSR_2BC.7 128.4,20.67 v128.4,19.4
  Top 0.3: DRV2.13 117,64.7 v116.5,64.2 | v116.5,60.3 116.5,51.5 v112.4,47.4 | v116.4,42.2 116.4,40.87 SSR_2DE.7
  Bottom 0.15: v116.5,19.4 v128.4,19.4
  Bottom 0.3: v116.5,60.3 v116.5,64.2 | v112.4,47.4 116.4,43.4 v116.4,42.2
CH2_O-  (via drill 0.3)
  Top 0.3: DRV2.14 117.51,64.69 v118,64.2 | v118,60.3 118,51.4 v112.4,45.8 | v112.4,8.3 113.8,8.3 116.1,6 116.4,6 | P-CH1+2.7 122.4,7.2 121.2,6 116.6,6 116.4,6 | P-CH1+2.1 116.4,6
  Bottom 0.3: v118,64.2 v118,60.3 | v112.4,45.8 v112.4,8.3
CH2_PA+
  Top 0.15: SSR_1J/2A.6 130.6,26.09 130.6,13.2 126.4,9 P-CH1+2.11
CH2_PB+
  Top 0.15: SSR_2BC.8 130.1,21.57 130.1,13.7 125.4,9 P-CH1+2.10
CH2_PC+
  Top 0.15: SSR_2BC.6 129.6,16.99 129.6,14.2 124.4,9 P-CH1+2.9
CH2_PD+
  Top 0.15: SSR_2DE.8 120.1,39.77 120.1,12.3 123.4,9 P-CH1+2.8
CH2_PE+
  Top 0.15: SSR_2DE.6 119.6,35.19 119.6,10.8 121.4,9 P-CH1+2.6
CH2_PF+
  Top 0.15: SSR_2FG.8 119.1,30.67 119.1,10.3 120.4,9 P-CH1+2.5
CH2_PG+
  Top 0.15: SSR_2FG.6 118.6,26.09 118.6,9.8 119.4,9 P-CH1+2.4
CH2_PH+
  Top 0.15: SSR_2HJ.8 118.1,21.57 118.1,9.3 118.4,9 P-CH1+2.3
CH2_PJ+
  Top 0.15: SSR_2HJ.6 117.6,16.99 117.6,9.2 117.4,9 P-CH1+2.2
CH3_I+  (via drill 0.3)
  Top 0.3: v108.6,83.2 108.6,69.5 107.49,68.39 DRV3.17
  Bottom 0.3: AUDIO_IN.21 89.14,102.66 v108.6,83.2
CH3_I-  (via drill 0.3)
  Top 0.3: DRV3.16 107.91,67.91 109.3,69.3 v109.3,83.9
  Bottom 0.3: AUDIO_IN.9 90.51,102.69 v109.3,83.9
CH3_O+  (via drill 0.3)
  Top 0.15: SSR_3GH.7 91.1,39.51 91.1,35.79 | 91.1,35.79 91.1,32.13 SSR_3J/4A.7 | SSR_3GH.5 91.1,35.79 | SSR_3AB.7 103.1,39.51 103.1,35.79 | 103.1,35.79 103.1,30.77 | 103.1,30.77 103.1,25.69 | 103.1,25.69 103.1,20.67 | 103.1,20.67 103.1,16.95 SSR_3EF.5 | SSR_3EF.7 103.1,20.67 | SSR_3CD.5 103.1,25.69 | SSR_3CD.7 103.1,30.77 | SSR_3AB.5 103.1,35.79
  Top 0.3: DRV3.13 98.8,64.4 v98.3,63.9 | v98.3,60.3 v98.3,52 91.2,44.9 91.2,42.13 SSR_3GH.7 | v104.2,46.1 103.2,45.1 103.2,42.13 SSR_3AB.7
  Bottom 0.3: v98.3,63.9 v98.3,60.3 | v98.3,52 v104.2,46.1
CH3_O-  (via drill 0.3)
  Top 0.3: DRV3.14 99.31,64.39 v99.8,63.9 | v99.8,60.3 99.8,51.3 94.7,46.2 v94.7,44.7 | v104.3,8.3 103.6,8.3 101.3,6 97.4,6 97.1,6 | 97.1,6 92.4,6 91.1,7.3 P-CH3+4.12 | P-CH3+4.18 97.1,6
  Bottom 0.3: v99.8,63.9 v99.8,60.3 | v94.7,44.7 94.7,17.9 v104.3,8.3
CH3_PA+
  Top 0.15: SSR_3AB.8 108.1,39.77 108.1,13.7 104.2,9.8 101.9,9.8 101.1,9 P-CH3+4.22
CH3_PB+
  Top 0.15: SSR_3AB.6 107.6,35.19 107.6,13.9 104,10.3 101.4,10.3 100.1,9 P-CH3+4.21
CH3_PC+
  Top 0.15: SSR_3CD.8 107.1,30.67 107.1,14.1 103.8,10.8 100.9,10.8 99.1,9 P-CH3+4.20
CH3_PD+
  Top 0.15: SSR_3CD.6 106.6,26.09 106.6,14.3 103.6,11.3 100.4,11.3 98.1,9 P-CH3+4.19
CH3_PE+
  Top 0.15: SSR_3EF.8 106.1,21.57 106.1,14.5 103.4,11.8 98.9,11.8 96.1,9 P-CH3+4.17
CH3_PF+
  Top 0.15: SSR_3EF.6 105.6,16.99 105.6,14.7 103.2,12.3 98.4,12.3 95.1,9 P-CH3+4.16
CH3_PG+
  Top 0.15: SSR_3GH.8 96.1,39.77 96.1,11 94.1,9 P-CH3+4.15
CH3_PH+
  Top 0.15: SSR_3GH.6 95.6,35.19 95.6,11.5 93.1,9 P-CH3+4.14
CH3_PJ+
  Top 0.15: SSR_3J/4A.8 95.1,30.67 95.1,12 92.1,9 P-CH3+4.13
CH4_I+  (via drill 0.3)
  Top 0.3: DRV4.17 88.91,68.39 v89.3,68
  Bottom 0.3: AUDIO_IN.7 85,89.6 90.4,84.2 90.4,69.1 v89.3,68
CH4_I-  (via drill 0.3)
  Top 0.3: DRV4.16 88.39,67.91 89,67.3 v90,67.3
  Bottom 0.3: AUDIO_IN.20 86.37,89.23 91.1,84.5 91.1,68.4 v90,67.3
CH4_O+  (via drill 0.3)
  Top 0.15: SSR_4DE.7 79.1,39.51 79.1,35.79 | 79.1,35.79 79.1,30.77 | 79.1,30.77 79.1,25.69 | 79.1,25.69 79.1,20.67 | 79.1,20.67 79.1,16.95 SSR_4HJ.5 | 79.1,20.67 SSR_4HJ.7 80.5,20.63 v80.5,19.4 | SSR_4FG.5 79.1,25.69 | SSR_4DE.5 79.1,35.79 | SSR_4FG.7 79.1,30.77 | SSR_3J/4A.5 91.1,24.33 91.1,20.67 | 91.1,20.67 91.1,16.95 SSR_4BC.5 | 91.1,20.67 SSR_4BC.7 92.4,20.67 v92.4,19.4
  Top 0.3: DRV4.13 80.6,64.3 v80.2,63.9 | SSR_4DE.7 79.2,42.13 79.2,44.2 81.3,46.3 81.3,59.2 v80.2,60.3
  Bottom 0.15: v80.5,19.4 v92.4,19.4
  Bottom 0.3: v80.2,63.9 v80.2,60.3
CH4_O-  (via drill 0.3)
  Top 0.3: DRV4.14 81.11,64.29 v81.5,63.9 | v81.5,60.3 82.8,59 v82.8,44.7 | v77.6,8.3 79.9,6 80.1,6 | P-CH3+4.7 86.1,7.2 84.9,6 80.7,6 80.1,6 | P-CH3+4.1 80.1,6
  Bottom 0.3: v81.5,63.9 v81.5,60.3 | v82.8,44.7 77.6,39.5 v77.6,8.3
CH4_PA+
  Top 0.15: SSR_3J/4A.6 94.6,26.09 94.6,15 94.6,14.7 94.6,13.5 90.1,9 P-CH3+4.11
CH4_PB+
  Top 0.15: SSR_4BC.8 94.1,21.57 94.1,14 89.1,9 P-CH3+4.10
CH4_PC+
  Top 0.15: SSR_4BC.6 93.6,16.99 93.6,14.5 88.1,9 P-CH3+4.9
CH4_PD+
  Top 0.15: SSR_4DE.8 84.1,39.77 84.1,12 87.1,9 P-CH3+4.8
CH4_PE+
  Top 0.15: SSR_4DE.6 83.6,35.19 83.6,10.5 85.1,9 P-CH3+4.6
CH4_PF+
  Top 0.15: SSR_4FG.8 83.1,30.67 83.1,10 84.1,9 P-CH3+4.5
CH4_PG+
  Top 0.15: SSR_4FG.6 82.6,26.09 82.6,9.5 83.1,9 P-CH3+4.4
CH4_PH+
  Top 0.15: SSR_4HJ.8 82.1,21.57 P-CH3+4.3
CH4_PJ+
  Top 0.15: SSR_4HJ.6 81.6,16.99 81.6,9.5 81.1,9 P-CH3+4.2
CH5_I+  (via drill 0.3)  (1 unrouted)
  Bottom 0.3: AUDIO_IN.18 80.86,78.36 71,68.5 v71,68
CH5_I-  (via drill 0.3)  (1 unrouted)
  Bottom 0.3: AUDIO_IN.6 82.23,78.83 71.7,68.3 v71.7,67.3
CH5_O+  (via drill 0.3)
  Top 0.15: SSR_5AB.7 67.1,39.51 67.1,35.79 | 67.1,35.79 67.1,30.77 | 67.1,30.77 67.1,25.69 | 67.1,25.69 67.1,20.67 | 67.1,20.67 67.1,16.95 SSR_5EF.5 | SSR_5EF.7 67.1,20.67 | SSR_5CD.5 67.1,25.69 | SSR_5CD.7 67.1,30.77 | SSR_5AB.5 67.1,35.79 | SSR_5GH.7 55.1,39.51 55.1,35.79 | 55.1,35.79 55.1,32.13 SSR_5J/6A.7 | SSR_5GH.5 55.1,35.79
  Top 0.3: DRV5.13 62.4,64 v62.1,63.7 | v62.1,60.3 v62.1,50.5 60.9,50.5 55.2,44.8 55.2,42.13 SSR_5GH.7 | v70.2,39.7 69.03,40.87 SSR_5AB.7
  Bottom 0.3: v62.1,63.7 v62.1,60.3 | v62.1,50.5 66.6,50.5 70.2,46.9 v70.2,39.7
CH5_O-  (via drill 0.3)
  Top 0.3: DRV5.14 62.91,64.09 v63.3,63.7 | v63.3,60.3 63.3,49.9 v58.1,44.7 | v68.1,8.3 67.2,8.3 64.9,6 61.6,6 60.9,6 | 60.9,6 56.2,6 54.9,7.3 P-CH5+6.12 | P-CH5+6.18 60.9,6
  Bottom 0.3: v63.3,63.7 v63.3,60.3 | v58.1,44.7 58.1,19.2 68.1,9.2 v68.1,8.3
CH5_PA+
  Top 0.15: SSR_5AB.8 72.1,39.77 72.1,13.6 67.9,9.4 65.3,9.4 64.9,9 P-CH5+6.22
CH5_PB+
  Top 0.15: SSR_5AB.6 71.6,35.19 71.6,13.9 67.6,9.9 64.8,9.9 63.9,9 P-CH5+6.21
CH5_PC+
  Top 0.15: SSR_5CD.8 71.1,30.67 71.1,14.2 67.3,10.4 64.3,10.4 62.9,9 P-CH5+6.20
CH5_PD+
  Top 0.15: SSR_5CD.6 70.6,26.09 70.6,14.5 67,10.9 63.8,10.9 61.9,9 P-CH5+6.19
CH5_PE+
  Top 0.15: SSR_5EF.8 70.1,21.57 70.1,14.8 66.7,11.4 62.3,11.4 59.9,9 P-CH5+6.17
CH5_PF+
  Top 0.15: SSR_5EF.6 69.6,16.99 69.6,15 66.5,11.9 61.8,11.9 58.9,9 P-CH5+6.16
CH5_PG+
  Top 0.15: SSR_5GH.8 60.1,39.77 60.1,11.2 57.9,9 P-CH5+6.15
CH5_PH+
  Top 0.15: SSR_5GH.6 59.6,35.19 59.6,11.7 56.9,9 P-CH5+6.14
CH5_PJ+
  Top 0.15: SSR_5J/6A.8 59.1,30.67 59.1,12.2 55.9,9 P-CH5+6.13
CH6_I+  (via drill 0.3)
  Top 0.3: DRV6.17 52.79,68.39 54,69.6 v54,79.3
  Bottom 0.3: AUDIO_IN.4 76.72,106.02 54,83.3 v54,79.3
CH6_I-  (via drill 0.3)
  Top 0.3: DRV6.16 53.31,67.91 54.7,69.3 v54.7,80
  Bottom 0.3: AUDIO_IN.17 78.09,105.99 54.7,82.6 v54.7,80
CH6_O+  (via drill 0.3)
  Top 0.15: SSR_6DE.7 43.2,39.51 43.2,35.79 | 43.2,35.79 43.2,30.77 | 43.2,30.77 43.2,25.69 | 43.2,25.69 43.2,20.67 | 43.2,20.67 43.2,16.95 SSR_6HJ.5 | 43.2,20.67 SSR_6HJ.7 44.6,20.67 v44.6,19.4 | SSR_6FG.5 43.2,25.69 | SSR_6FG.7 43.2,30.77 | SSR_6DE.5 43.2,35.79 | SSR_5J/6A.5 55.1,24.33 55.1,20.67 | 55.1,20.67 55.1,16.95 SSR_6BC.5 | 55.1,20.67 SSR_6BC.7 56.4,20.67 v56.4,19.4
  Top 0.3: DRV6.13 44.2,64.4 v43.7,63.9 | v43.7,60.3 43.3,59.9 43.3,42.13 SSR_6DE.7
  Bottom 0.15: v44.6,19.4 v56.4,19.4
  Bottom 0.3: v43.7,63.9 v43.7,60.3
CH6_O-  (via drill 0.3)
  Top 0.3: DRV6.14 44.71,64.39 v45.2,63.9 | v45.2,60.3 45.2,46 v46.9,44.3 | v41.7,8.3 41.7,8.1 43.8,6 43.9,6 | P-CH5+6.7 49.9,7.3 48.6,6 44.3,6 43.9,6 | P-CH5+6.1 43.9,6
  Bottom 0.3: v45.2,63.9 v45.2,60.3 | v46.9,44.3 41.7,39.1 v41.7,8.3
CH6_PA+
  Top 0.15: SSR_5J/6A.6 58.6,26.09 58.6,13.7 53.9,9 P-CH5+6.11
CH6_PB+
  Top 0.15: SSR_6BC.8 58.1,21.57 58.1,14.2 52.9,9 P-CH5+6.10
CH6_PC+
  Top 0.15: SSR_6BC.6 57.6,16.99 57.6,14.7 51.9,9 P-CH5+6.9
CH6_PD+
  Top 0.15: SSR_6DE.8 48.2,39.77 48.2,11.7 50.9,9 P-CH5+6.8
CH6_PE+
  Top 0.15: SSR_6DE.6 47.7,35.19 47.7,10.2 48.9,9 P-CH5+6.6
CH6_PF+
  Top 0.15: SSR_6FG.8 47.2,30.67 47.2,9.7 47.9,9 P-CH5+6.5
CH6_PG+
  Top 0.15: SSR_6FG.6 46.7,26.09 46.7,9.2 46.9,9 P-CH5+6.4
CH6_PH+
  Top 0.15: SSR_6HJ.8 46.2,21.57 46.2,9.3 45.9,9 P-CH5+6.3
CH6_PJ+
  Top 0.15: SSR_6HJ.6 45.7,16.99 45.7,9.8 44.9,9 P-CH5+6.2
CH7_I+  (via drill 0.3)
  Top 0.3: DRV7.17 32.71,68.39 v33,68.1 | v37.8,73.5 44.1,79.8 v47.9,79.8
  Bottom 0.3: AUDIO_IN.15 72.58,104.08 48.3,79.8 v47.9,79.8 | v37.8,73.5 33,68.7 v33,68.1
CH7_I-  (via drill 0.3)
  Top 0.3: DRV7.16 28.49,67.4 v33.7,67.4 | v38.5,72.8 44.8,79.1 v48.6,79.1
  Bottom 0.3: AUDIO_IN.3 73.95,104.45 v48.6,79.1 | v33.7,67.4 33.7,68 v38.5,72.8
CH7_O+  (via drill 0.3)
  Top 0.15: SSR_7EF.5 31.2,16.95 31.2,20.67 | 31.2,20.67 31.2,25.69 | 31.2,25.69 31.2,30.77 | 31.2,30.77 31.2,35.79 | 31.2,35.79 31.2,39.51 SSR_7AB.7 | SSR_7GH.7 19.2,39.51 19.2,35.79 | 19.2,35.79 19.2,32.13 SSR_7J/8A.7 | SSR_7GH.5 19.2,35.79 | SSR_7EF.7 31.2,20.67 | SSR_7CD.5 31.2,25.69 | SSR_7CD.7 31.2,30.77 | SSR_7AB.5 31.2,35.79
  Top 0.3: DRV7.13 26,64.4 v25.5,63.9 | v25.5,60.3 v25.5,49.8 20.8,45.1 20.2,45.1 19.3,44.2 19.3,42.13 SSR_7GH.7 | v28.4,49.8 29.9,49.8 32.1,47.6 32.1,45 31.3,44.2 31.3,42.13 SSR_7AB.7
  Bottom 0.3: v25.5,63.9 v25.5,60.3 | v25.5,49.8 v28.4,49.8
CH7_O-  (via drill 0.3)
  Top 0.3: DRV7.14 26.51,64.39 v27,63.9 | v27,60.3 27,49.5 v22.6,45.1 | v31.7,8.3 30.9,8.3 28.6,6 24.8,6 24.5,6 | 24.5,6 19.8,6 18.5,7.3 P-CH7+8.12 | P-CH7+8.18 24.5,6
  Bottom 0.3: v27,63.9 v27,60.3 | v22.6,45.1 22.6,18.4 31.7,9.3 v31.7,8.3
CH7_PA+
  Top 0.15: SSR_7AB.8 36.2,39.77 36.2,14.1 31.3,9.2 28.7,9.2 28.5,9 P-CH7+8.22
CH7_PB+
  Top 0.15: SSR_7AB.6 35.7,35.19 35.7,14.3 31.1,9.7 28.2,9.7 27.5,9 P-CH7+8.21
CH7_PC+
  Top 0.15: SSR_7CD.8 35.2,30.67 35.2,14.5 30.9,10.2 27.7,10.2 26.5,9 P-CH7+8.20
CH7_PD+
  Top 0.15: SSR_7CD.6 34.7,26.09 34.7,14.7 30.7,10.7 27.2,10.7 25.5,9 P-CH7+8.19
CH7_PE+
  Top 0.15: SSR_7EF.8 34.2,21.57 34.2,14.9 30.5,11.2 25.7,11.2 23.5,9 P-CH7+8.17
CH7_PF+
  Top 0.15: SSR_7EF.6 33.7,16.99 33.7,15.1 30.3,11.7 25.2,11.7 22.5,9 P-CH7+8.16
CH7_PG+
  Top 0.15: SSR_7GH.8 24.2,39.77 24.2,11.7 21.5,9 P-CH7+8.15
CH7_PH+
  Top 0.15: SSR_7GH.6 23.7,35.19 23.7,12.2 20.5,9 P-CH7+8.14
CH7_PJ+
  Top 0.15: SSR_7J/8A.8 23.2,30.67 23.2,12.7 19.5,9 P-CH7+8.13
CH8_I+  (via drill 0.3)
  Top 0.3: DRV8.17 16.29,68.39 17.6,69.7 17.6,71.9 v17.9,72.2
  Bottom 0.3: AUDIO_IN.1 68.44,101.94 50.9,84.4 30.1,84.4 v17.9,72.2
CH8_I-  (via drill 0.3)
  Top 0.3: DRV8.16 16.71,67.91 18.3,69.5 18.3,71.3 v19.2,72.2
  Bottom 0.3: AUDIO_IN.14 69.81,102.31 51.2,83.7 30.7,83.7 v19.2,72.2
CH8_O+  (via drill 0.3)
  Top 0.15: SSR_8DE.7 7.2,39.51 7.2,35.79 | 7.2,35.79 7.2,30.77 | 7.2,30.77 7.2,25.69 | 7.2,25.69 7.2,20.67 | 7.2,20.67 7.2,16.95 SSR_8HJ.5 | SSR_7J/8A.5 19.2,24.33 19.2,20.67 | 19.2,20.67 19.2,16.95 SSR_8BC.5 | 19.2,20.67 SSR_8BC.7 20.5,20.67 v20.5,19.4 | SSR_8HJ.7 7.2,20.67 | SSR_8FG.5 7.2,25.69 | SSR_8FG.7 7.2,30.77 | SSR_8DE.5 7.2,35.79 | 8.6,20.67 v8.6,19.4
  Top 0.3: DRV8.13 7.8,64.4 v7.3,63.9 | v7.3,60.3 7.3,42.13 SSR_8DE.7 | SSR_8HJ.7 8.6,20.67
  Bottom 0.15: v8.6,19.4 v20.5,19.4
  Bottom 0.3: v7.3,63.9 v7.3,60.3
CH8_O-  (via drill 0.3)
  Top 0.3: DRV8.14 8.31,64.39 v8.8,63.9 | v8.8,60.3 8.8,46.3 v10.8,44.3 | v5.7,8.3 5.7,7.7 7.4,6 7.5,6 | P-CH7+8.7 13.5,7.3 12.2,6 8,6 7.5,6 | P-CH7+8.1 7.5,6
  Bottom 0.3: v8.8,63.9 v8.8,60.3 | v10.8,44.3 5.7,39.2 v5.7,8.3
CH8_PA+
  Top 0.15: SSR_7J/8A.6 22.7,26.09 22.7,15.1 22.7,14.6 22.7,14.2 17.5,9 P-CH7+8.11
CH8_PB+
  Top 0.15: SSR_8BC.8 22.2,21.57 22.2,14.7 16.5,9 P-CH7+8.10
CH8_PC+
  Top 0.15: SSR_8BC.6 21.7,16.99 21.7,15.2 15.5,9 P-CH7+8.9
CH8_PD+
  Top 0.15: SSR_8DE.8 12.2,39.77 12.2,11.3 14.5,9 P-CH7+8.8
CH8_PE+
  Top 0.15: SSR_8DE.6 11.7,35.19 11.7,9.8 12.5,9 P-CH7+8.6
CH8_PF+
  Top 0.15: SSR_8FG.8 11.2,30.67 11.2,9.3 11.5,9 P-CH7+8.5
CH8_PG+
  Top 0.15: SSR_8FG.6 10.7,26.09 10.7,9.2 10.5,9 P-CH7+8.4
CH8_PH+
  Top 0.15: SSR_8HJ.8 10.2,21.57 10.2,9.7 9.5,9 P-CH7+8.3
CH8_PJ+
  Top 0.15: SSR_8HJ.6 9.7,16.99 9.7,10.2 8.5,9 P-CH7+8.2
CVBST1  (via drill 0.5)  (1 unrouted)
  Top 0.2: 133.1,67.9 133,67.9 131.3,66.2 | 131.3,66.2 131.3,65.1 134.7,65.1 134.7,66.9 134.2,66.9 | 134.2,66.9 133.9,66.9 133.4,67.4 133.4,67.8 133.3,67.9 | 133.3,67.9 133.1,67.9 | 133.1,67.9 133.1,67.8 131.5,66.2 131.5,65.2 134.6,65.2 134.6,66.8 133.8,66.8 133.3,67.3 133.3,67.8 131.6,66.1 131.6,65.3 134.5,65.3 134.5,66.7 133.7,66.7 133.2,67.2 133.2,67.5 131.7,66 131.7,65.4 134.4,65.4 134.4,66.6 133.6,66.6 133.1,67.1 133.1,67.2 131.8,65.9 131.8,65.5 134.3,65.5 134.3,66.5 133.5,66.5 133,67 131.9,65.9 131.9,65.6 134.2,65.6 134.2,66.4 133.4,66.4 133,66.8 132,65.8 132,65.7 134.1,65.7 134.1,66.3 133.3,66.3 133,66.6 132.2,65.8 v132.9,66.1 134,65.8 134,66.2 133.2,66.2 133,66.4 132.5,65.9 133.9,65.9 133.9,66.1 133.1,66.1 133,66.2 132.8,66 133.1,66 | CVBST1.1 130.85,65.75 131.3,66.2 | DRV1.11 134.2,66.9 | DRV1.10 133.29,67.91 133.3,67.9
  Top 0.3: RVBST1-1.2 v135.2,75.6
  Bottom 0.3: v135.2,75.6 132.9,73.3 v132.9,66.1
CVBST2  (via drill 0.5)
  Top 0.2: 113.1,65.7 113.1,65.1 116.5,65.1 116.5,66.9 116.49,66.91 DRV2.12 | 113.1,65.7 113.1,66.3 114.7,67.9 115,67.9 | 115,67.9 115.2,67.9 115.2,67.3 115.6,66.9 116,66.9 | 116,66.9 116.4,66.9 116.4,65.2 113.2,65.2 113.2,66.3 114.7,67.8 115.1,67.8 115.1,67.2 115.5,66.8 116.3,66.8 116.3,65.3 113.3,65.3 113.3,66.2 114.8,67.7 115,67.7 115,67.1 115.4,66.7 116.2,66.7 116.2,65.4 113.4,65.4 113.4,66.1 114.9,67.6 114.9,67 115.3,66.6 116.1,66.6 116.1,65.5 113.5,65.5 113.5,66 114.8,67.3 114.8,66.9 115.2,66.5 116,66.5 116,65.6 113.6,65.6 113.6,65.9 114.7,67 114.7,66.8 115.1,66.4 115.9,66.4 115.9,65.7 113.7,65.7 113.7,65.8 114.6,66.7 v114.65,66.15 115,66.3 | 115,66.3 115.8,66.3 115.8,65.8 113.9,65.8 114.6,66.5 114.9,66.2 115.7,66.2 115.7,65.9 114.2,65.9 114.6,66.3 114.8,66.1 115.6,66.1 115.6,66 114.5,66 114.6,66.1 | DRV2.11 116,66.9 | DRV2.10 115,67.9 | CVBST2.1 113.1,65.7 | 114.7,66.6 115,66.3
  Top 0.3: RVBST2-1.2 v117,75.6
  Bottom 0.3: v114.65,66.15 114.65,73.25 v117,75.6
CVBST3  (via drill 0.5)  (1 unrouted)
  Top 0.2: 94.9,65.7 94.9,65.1 98.3,65.1 98.3,66.9 98.29,66.91 DRV3.12 | 94.9,65.7 94.9,66.4 96.4,67.9 96.8,67.9 | 96.8,67.9 97,67.9 97,67.2 97.3,66.9 97.8,66.9 | 97.8,66.9 98.2,66.9 98.2,65.2 95,65.2 95,66.3 96.5,67.8 96.9,67.8 96.9,67.1 97.2,66.8 98.1,66.8 98.1,65.3 95.1,65.3 95.1,66.2 96.6,67.7 96.8,67.7 96.8,67 97.1,66.7 98,66.7 98,65.4 95.2,65.4 95.2,66.1 96.7,67.6 96.7,66.9 97,66.6 97.9,66.6 97.9,65.5 95.3,65.5 95.3,66 96.6,67.3 96.6,66.8 96.9,66.5 97.8,66.5 97.8,65.6 95.4,65.6 95.4,65.9 96.5,67 96.5,66.7 96.8,66.4 97.7,66.4 97.7,65.7 95.5,65.7 95.5,65.8 96.4,66.7 96.4,66.6 96.7,66.3 97.6,66.3 97.6,65.8 95.7,65.8 96.4,66.5 96.7,66.2 97.5,66.2 97.5,65.9 96,65.9 96.4,66.3 96.6,66.1 97.4,66.1 97.4,66 96.3,66 96.4,66.1 | DRV3.10 96.81,67.91 96.8,67.9 | DRV3.11 97.8,66.9 | CVBST3.1 94.9,65.7
  Top 0.3: RVBST3-1.2 v98.8,75.6
  Bottom 0.3: v98.8,75.6 96.5,73.3 v96.5,66.1
CVBST4  (via drill 0.5)  (1 unrouted)
  Top 0.2: 76.7,65.7 76.7,65.1 80.1,65.1 80.1,66.9 80.09,66.91 DRV4.12 DRV4.11 | 76.7,65.7 76.7,66.4 78.2,67.9 78.6,67.9 | 78.6,67.9 78.8,67.9 78.8,67.2 79.1,66.9 80,66.9 80,65.2 76.8,65.2 76.8,66.3 78.3,67.8 78.7,67.8 78.7,67.1 79,66.8 79.9,66.8 79.9,65.3 76.9,65.3 76.9,66.2 78.4,67.7 78.6,67.7 78.6,67 78.9,66.7 79.8,66.7 79.8,65.4 77,65.4 77,66.1 78.5,67.6 78.5,66.9 78.8,66.6 79.7,66.6 79.7,65.5 77.1,65.5 77.1,66 78.4,67.3 78.4,66.8 78.7,66.5 79.6,66.5 79.6,65.6 77.2,65.6 77.2,65.9 78.3,67 78.3,66.7 78.6,66.4 79.5,66.4 79.5,65.7 77.3,65.7 77.3,65.8 78.2,66.7 78.2,66.6 78.5,66.3 79.4,66.3 79.4,65.8 77.5,65.8 78.2,66.5 78.5,66.2 79.3,66.2 79.3,65.9 77.8,65.9 78.2,66.3 78.4,66.1 79.2,66.1 79.2,66 78.1,66 78.2,66.1 | CVBST4.1 76.7,65.7 | DRV4.10 78.61,67.91 78.6,67.9
  Top 0.3: RVBST4-1.2 v80.6,75.6
  Bottom 0.3: v80.6,75.6 78.3,73.3 v78.3,66.1
CVBST5  (via drill 0.5)
  Top 0.2: 58.5,65.7 58.5,65.1 61.9,65.1 61.9,66.9 61.89,66.91 DRV5.12 DRV5.11 | 58.5,65.7 58.5,66.4 60,67.9 60.6,67.9 60.6,67.2 60.9,66.9 61.8,66.9 61.8,65.2 58.6,65.2 58.6,66.3 60.1,67.8 60.5,67.8 | 60.5,67.8 60.5,67.1 60.8,66.8 61.7,66.8 61.7,65.3 58.7,65.3 58.7,66.2 60.2,67.7 60.4,67.7 60.4,67 60.7,66.7 61.6,66.7 61.6,65.4 58.8,65.4 58.8,66.1 60.3,67.6 60.3,66.9 60.6,66.6 61.5,66.6 61.5,65.5 58.9,65.5 58.9,66 60.2,67.3 60.2,66.8 60.5,66.5 61.4,66.5 61.4,65.6 59,65.6 59,65.9 60.1,67 60.1,66.7 60.4,66.4 61.3,66.4 61.3,65.7 59.1,65.7 59.1,65.8 60,66.7 60.4,66.3 61.2,66.3 61.2,65.8 59.3,65.8 60,66.5 60.4,66.1 61.1,66.1 61.1,66 59.6,66 59.6,65.9 60,66.3 60.1,66.3 60.3,66.1 v60.1,66.1 60,66.1 | CVBST5.1 58.5,65.7 | DRV5.10 60.42,67.88 60.5,67.8
  Top 0.3: RVBST5-1.2 v62.4,75.6
  Bottom 0.3: v62.4,75.6 60.1,73.3 v60.1,66.1
CVBST6  (via drill 0.5)
  Top 0.2: 40.3,65.7 40.3,65.1 43.7,65.1 DRV6.12 | 40.3,65.7 40.3,66.4 41.8,67.9 42.2,67.9 | 42.2,67.9 42.4,67.9 42.4,67.3 42.8,66.9 43.2,66.9 | 43.2,66.9 43.6,66.9 43.6,65.2 40.4,65.2 40.4,66.3 41.9,67.8 42.3,67.8 42.3,67.2 42.7,66.8 43.5,66.8 43.5,65.3 40.5,65.3 40.5,66.2 42,67.7 42.2,67.7 42.2,67.1 42.6,66.7 43.4,66.7 43.4,65.4 40.6,65.4 40.6,66.1 42.1,67.6 42.1,67 42.5,66.6 43.3,66.6 43.3,65.5 40.7,65.5 40.7,66 42,67.3 42,66.9 42.4,66.5 43.2,66.5 43.2,65.6 40.8,65.6 40.8,65.9 41.9,67 41.9,66.8 42.3,66.4 43.1,66.4 43.1,65.7 40.9,65.7 40.9,65.8 41.8,66.7 42.3,66.2 43,66.2 43,65.8 41.1,65.8 41.8,66.5 41.9,66.5 42.3,66.1 42.9,66.1 42.9,65.9 41.4,65.9 41.9,66.4 41.9,66.3 42.2,66 41.7,66 41.9,66.2 v41.9,66.1 | CVBST6.1 40.3,65.7 | DRV6.11 43.2,66.9 | DRV6.10 42.2,67.9
  Top 0.3: RVBST6-1.2 v44.2,75.6
  Bottom 0.3: v44.2,75.6 41.9,73.3 v41.9,66.1
CVBST7  (via drill 0.5)  (1 unrouted)
  Top 0.2: 22.1,65.7 22.1,65.1 25.5,65.1 DRV7.12 | 22.1,65.7 22.1,66.4 23.6,67.9 24.2,67.9 24.2,67.2 24.5,66.9 24.9,66.9 | 24.9,66.9 25.4,66.9 25.4,65.2 22.2,65.2 22.2,66.3 23.7,67.8 24.1,67.8 24.1,67.1 24.4,66.8 25.3,66.8 25.3,65.3 22.3,65.3 22.3,66.2 23.8,67.7 24,67.7 | 24,67.7 24,67 24.3,66.7 25.2,66.7 25.2,65.4 22.4,65.4 22.4,66.1 23.9,67.6 23.9,66.9 24.2,66.6 25.1,66.6 25.1,65.5 22.5,65.5 22.5,66 23.8,67.3 23.8,66.8 24.1,66.5 25,66.5 25,65.6 22.6,65.6 22.6,65.9 23.7,67 23.7,66.8 24.1,66.4 24.9,66.4 24.9,65.7 24.8,65.7 | 23,65.7 22.7,65.7 22.7,65.8 23.6,66.7 24,66.3 24.8,66.3 24.8,65.7 | 24.8,65.7 23,65.7 | 23,65.7 22.9,65.8 23.6,66.5 23.9,66.2 24.7,66.2 24.7,65.8 23.1,65.8 23.6,66.3 23.8,66.1 24.6,66.1 24.6,65.9 23.4,65.9 23.6,66.1 23.7,66 | CVBST7.1 22.1,65.7 | DRV7.11 24.92,66.92 24.9,66.9 | DRV7.10 24.02,67.72 24,67.7
  Top 0.3: RVBST7-1.2 v26,75.6
  Bottom 0.6: v26,75.6 23.7,73.3 v23.7,66.1
CVBST8  (via drill 0.5)  (1 unrouted)
  Top 0.2: 3.9,65.6 3.9,65.1 7.3,65.1 DRV8.12 | 3.9,65.6 3.9,66.4 5.4,67.9 6,67.9 6,67.2 6.3,66.9 6.8,66.9 | 6.8,66.9 7.2,66.9 7.2,65.2 4,65.2 4,66.3 5.5,67.8 5.8,67.8 | 5.8,67.8 5.9,67.8 5.9,67.1 6.2,66.8 7.1,66.8 7.1,65.3 4.1,65.3 4.1,66.2 5.6,67.7 5.8,67.7 5.8,67.1 6.2,66.7 7,66.7 7,65.4 4.2,65.4 4.2,66.1 5.7,67.6 5.7,67 6.1,66.6 6.9,66.6 6.9,65.5 4.3,65.5 4.3,66 5.6,67.3 5.6,66.9 6,66.5 6.8,66.5 6.8,65.6 4.4,65.6 4.4,65.9 5.5,67 5.5,66.8 5.9,66.4 6.7,66.4 6.7,65.7 4.5,65.7 4.5,65.8 5.4,66.7 5.8,66.3 6.6,66.3 6.6,65.8 4.7,65.8 5.4,66.5 5.7,66.2 6.5,66.2 6.5,65.9 5,65.9 5.4,66.3 5.6,66.1 6.4,66.1 6.4,66 5.3,66 5.4,66.1 | CVBST8.1 3.8,65.7 3.9,65.6 | DRV8.11 6.8,66.9 | DRV8.10 5.82,67.82 5.8,67.8
  Top 0.3: RVBST8-1.2 v7.8,75.6
  Bottom 0.6: v7.8,75.6 5.5,73.3 v5.5,66.1
GND
  Top 0.3: AUDIO_IN.2 71.21,115.1 71.6,115.1 | AUDIO_IN.16 75.35,115.1 75.6,115.1 | AUDIO_IN.5 79.49,115.1 79.4,115.1 | AUDIO_IN.19 83.63,115.1 83.8,115.1 | AUDIO_IN.8 87.77,115.1 87.7,115.1 | AUDIO_IN.25 100.19,115.1 100.3,115.1 | AUDIO_IN.11 96.05,115.1 96.2,115.1 | AUDIO_IN.22 91.91,115.1 91.8,115.1
  Top 1: 71.4,115.1 71.6,115.1 75.6,115.1 79.4,115.1 83.8,115.1 87.7,115.1 91.8,115.1 96.2,115.1 100.3,115.1 107.3,115.1 115.2,123 133.15,123 GND_LIFT.1 GND_LIFT.6
L1
  Top 0.2: 132.7,69.1 131.8,68.2 131.85,68.15 | 132.7,69.1 132.8,69.1 | 132.7,69.1 132.5,69.1 131.8,69.8 131.8,68.4 132.4,69 131.9,69.5 | 131.9,69.5 131.9,68.7 132.2,69 132,69.2 132,69 | 133.2,68.9 132.8,68.9 131.5,67.6 131.5,70.7 132.8,69.4 133.2,69.4 133.21,69.41 DRV1.7 | 133.2,68.9 133.2,69 | 133.2,69.2 133.2,69.3 132.7,69.3 131.6,70.4 131.6,67.9 131.85,68.15 | 131.85,68.15 132.7,69 133.2,69 | 133.2,69 133.2,69.2 | 133.2,69.2 132.6,69.2 131.7,70.1 131.7,68.2 | 131.9,69.5 131.3,69.5 L1.1 | DRV1.8 133.2,68.9
L2
  Top 0.2: 113.7,68.8 113.7,69.6 114.2,69.1 113.6,68.5 113.6,69.8 114.3,69.1 114.4,69.1 113.5,68.2 113.5,70.1 114.4,69.2 114.9,69.2 114.9,69.1 114.6,69.1 113.4,67.9 113.4,70.4 114.5,69.3 115,69.3 115,69.39 DRV2.7 | 113.7,68.8 114,69.1 113.8,69.3 113.8,69.1 | 115,69.2 115,68.9 114.6,68.9 113.3,67.6 113.3,70.7 114.6,69.4 DRV2.7 | 113.7,68.8 113.11,68.8 L2.1 | DRV2.7 DRV2.8
L3
  Top 0.2: 96.8,68.9 96.4,68.9 95.1,67.6 95.1,70.7 96.4,69.4 96.8,69.4 96.81,69.41 DRV3.7 | 96.8,68.9 96.8,69.2 96.4,69.2 95.2,70.4 95.2,67.9 96.4,69.1 | 96.4,69.1 96.7,69.1 | 96.4,69.1 96.3,69.1 95.3,70.1 95.3,68.2 96.2,69.1 95.4,69.9 95.4,68.5 96,69.1 95.5,69.6 95.5,68.8 | 95.5,68.8 95.8,69.1 95.6,69.3 95.6,69.1 | 95.5,68.8 94.91,68.8 L3.1 | DRV3.8 96.8,68.9
L4
  Top 0.2: 78.6,68.9 78.2,68.9 76.9,67.6 76.9,70.7 78.2,69.4 78.6,69.4 78.61,69.41 DRV4.7 | 78.6,68.9 78.6,69.2 78.2,69.2 77,70.4 77,67.9 78.2,69.1 | 78.2,69.1 78.5,69.1 | 78.2,69.1 78.1,69.1 77.1,70.1 77.1,68.2 78,69.1 77.2,69.9 77.2,68.5 77.8,69.1 77.3,69.6 77.3,68.8 | 77.3,68.8 77.6,69.1 77.4,69.3 77.4,69.1 | 77.3,68.8 76.7,68.8 L4.1 | DRV4.8 78.6,68.9
L5
  Top 0.2: 58.7,69.1 58.7,70.7 60,69.4 DRV5.7 DRV5.8 | 58.7,69.1 58.7,67.6 60,68.9 60.4,68.9 60.4,69.2 60,69.2 58.8,70.4 58.8,67.9 60,69.1 | 60,69.1 60.3,69.1 | 60,69.1 59.9,69.1 58.9,70.1 58.9,68.2 59.8,69.1 59,69.9 59,68.5 59.6,69.1 59.1,69.6 59.1,68.8 59.4,69.1 59.2,69.3 59.2,69.1 | L5.1 58.64,69.16 58.7,69.1
L6
  Top 0.2: 42.2,68.9 41.8,68.9 40.5,67.6 40.5,70.7 41.8,69.4 42.2,69.4 42.21,69.41 DRV6.7 | 42.2,68.9 42.2,69.2 41.8,69.2 40.6,70.4 40.6,67.9 41.8,69.1 | 41.8,69.1 42.1,69.1 | 41.8,69.1 41.7,69.1 40.7,70.1 40.7,68.2 41.6,69.1 40.8,69.9 40.8,68.5 41.4,69.1 40.9,69.6 40.9,68.8 | 40.9,68.8 41.2,69.1 41,69.3 41,69.1 | 40.9,68.8 40.3,68.8 L6.1 | DRV6.8 42.2,68.9
L7